# Altium project GF45RFSOI_Tapeout_DEC2020.PrjPcb
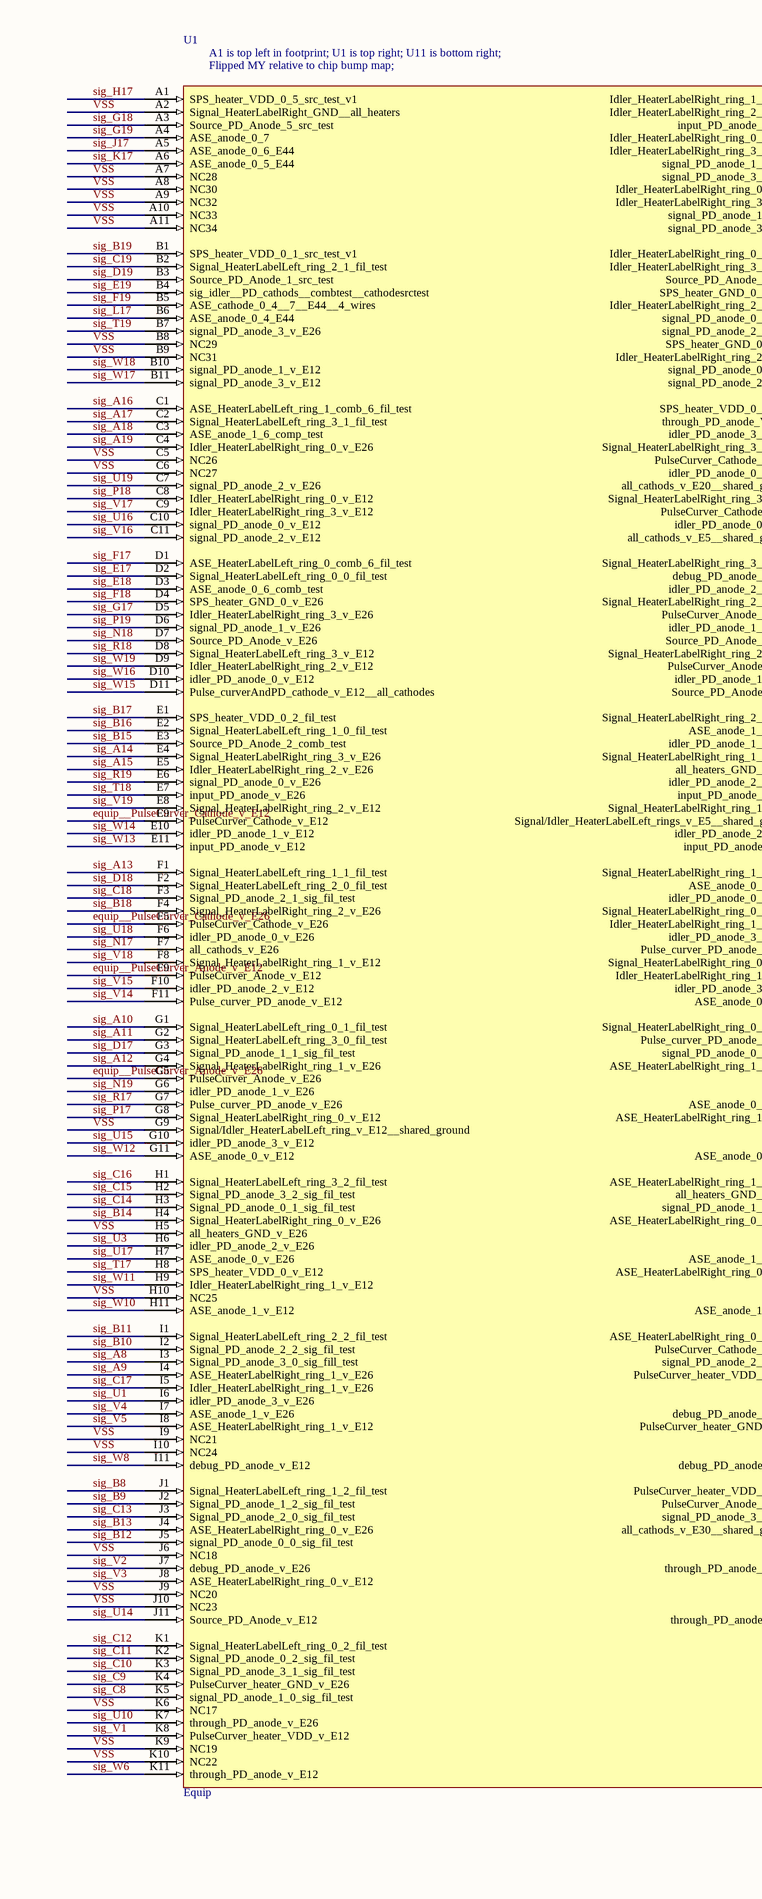
[diagram p0: Schematic.SchDoc, top left]
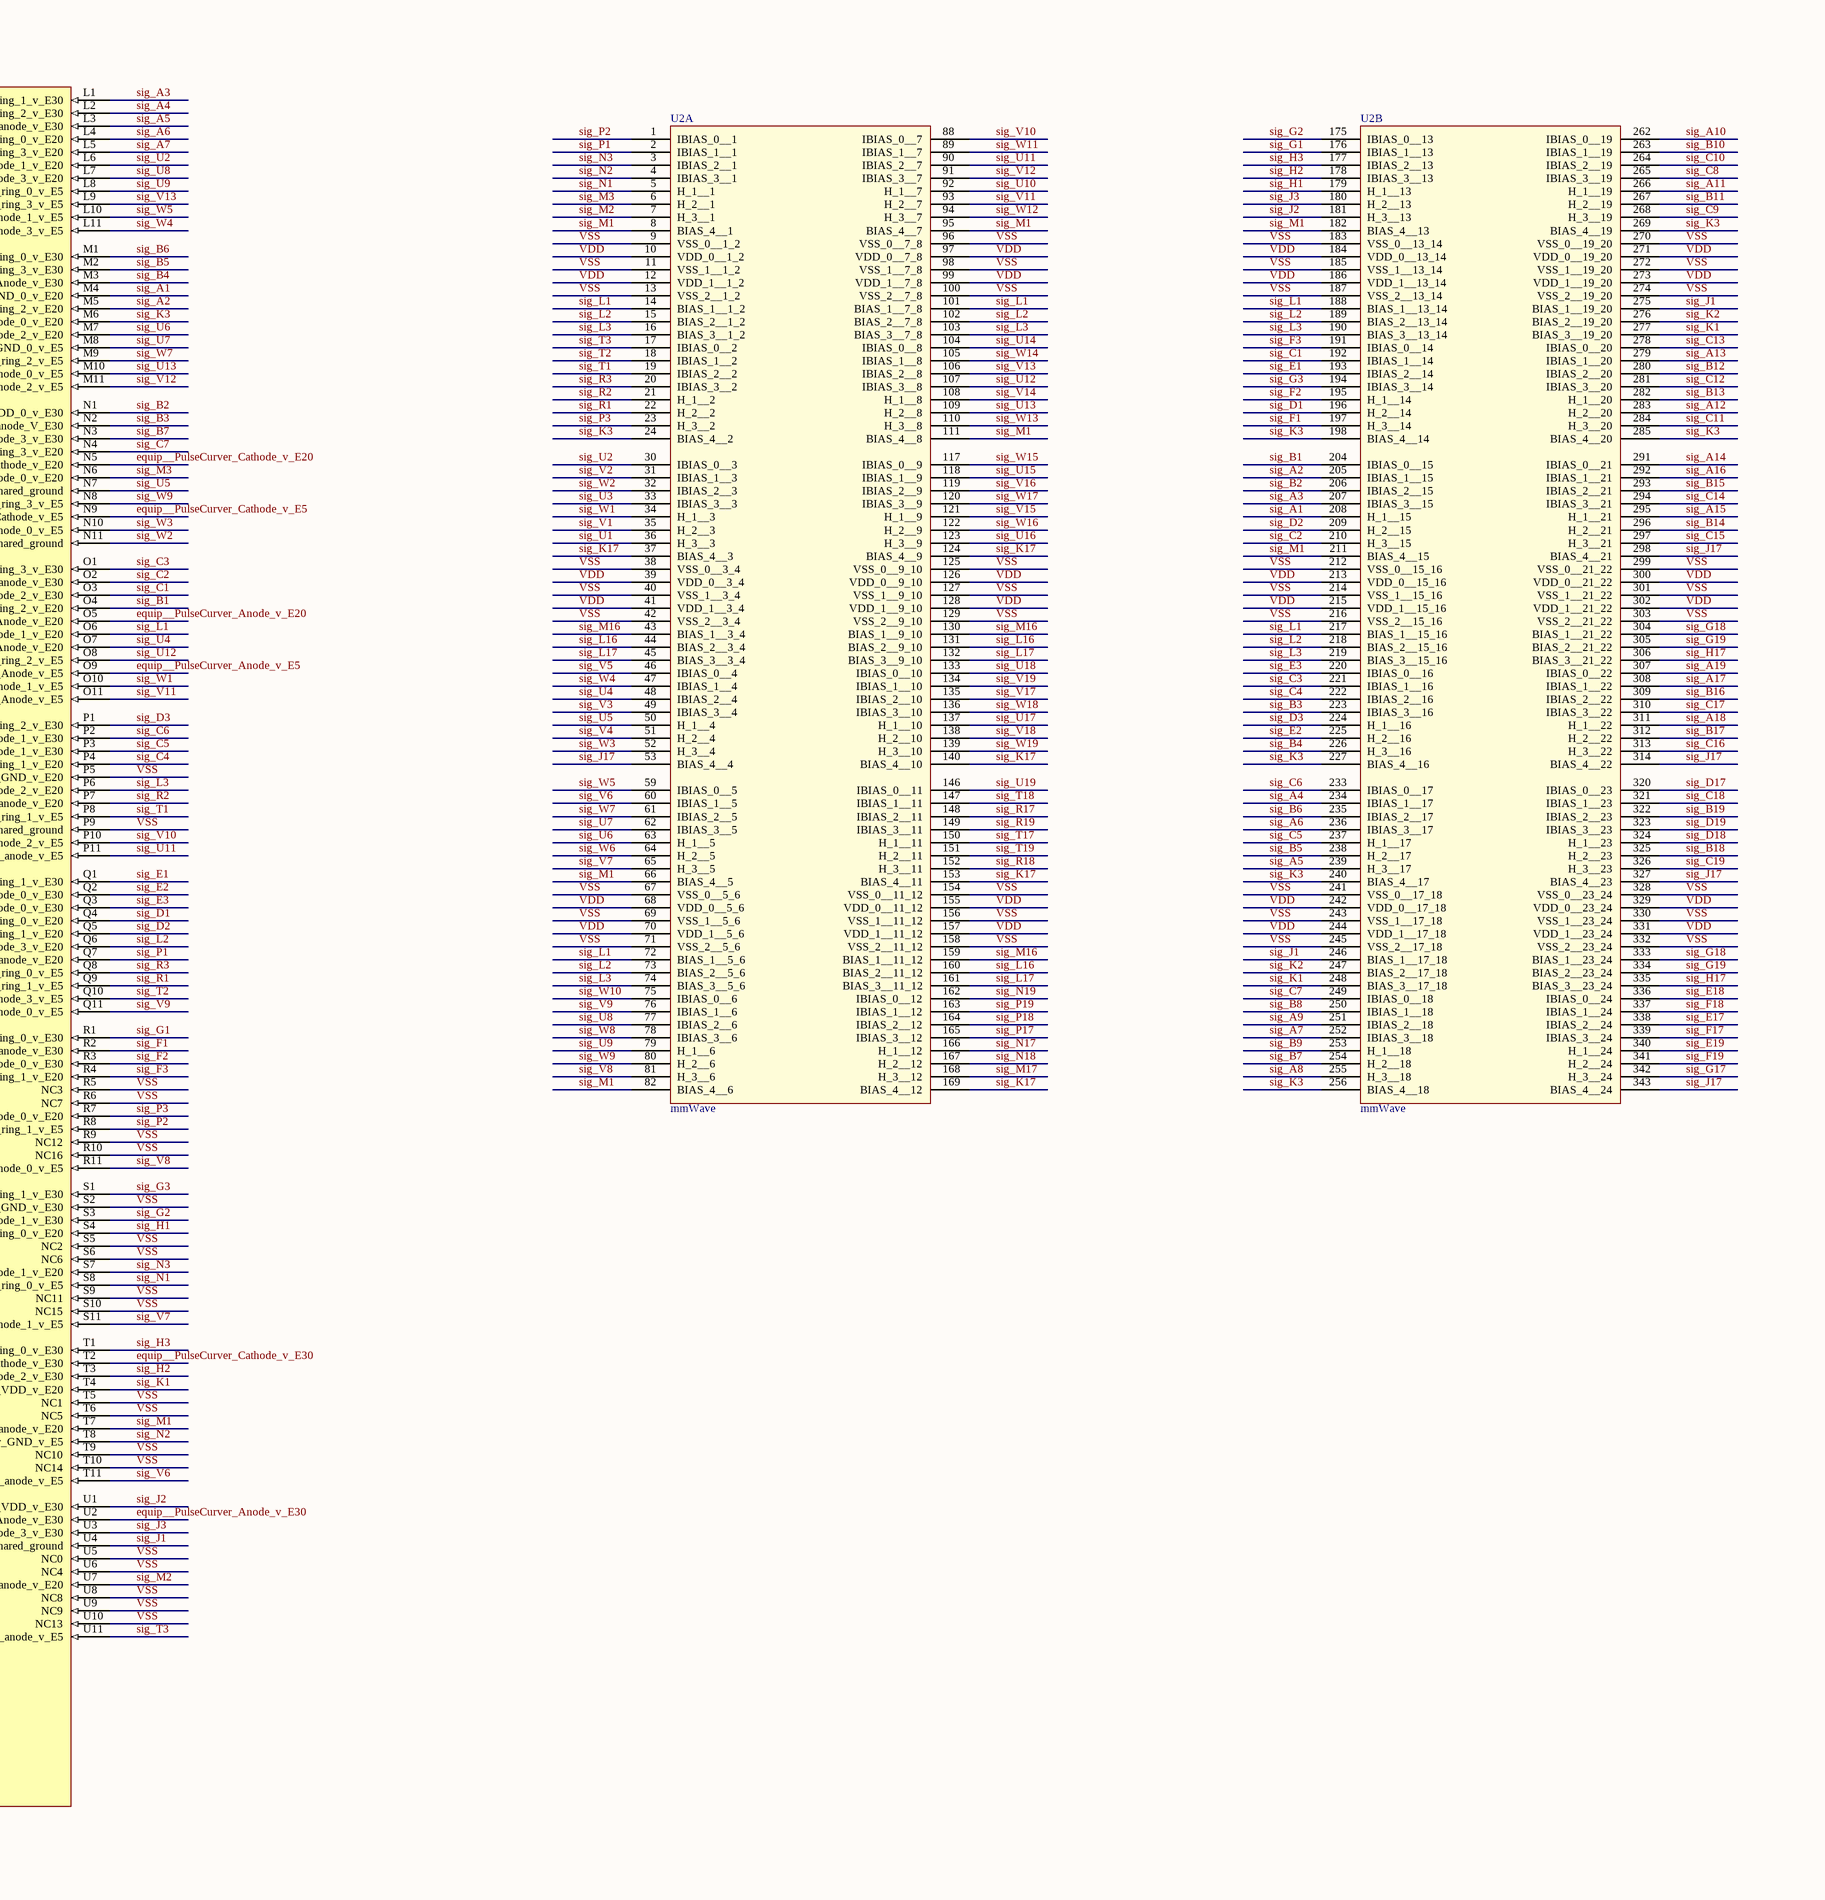
[diagram p1: Schematic.SchDoc, top middle]
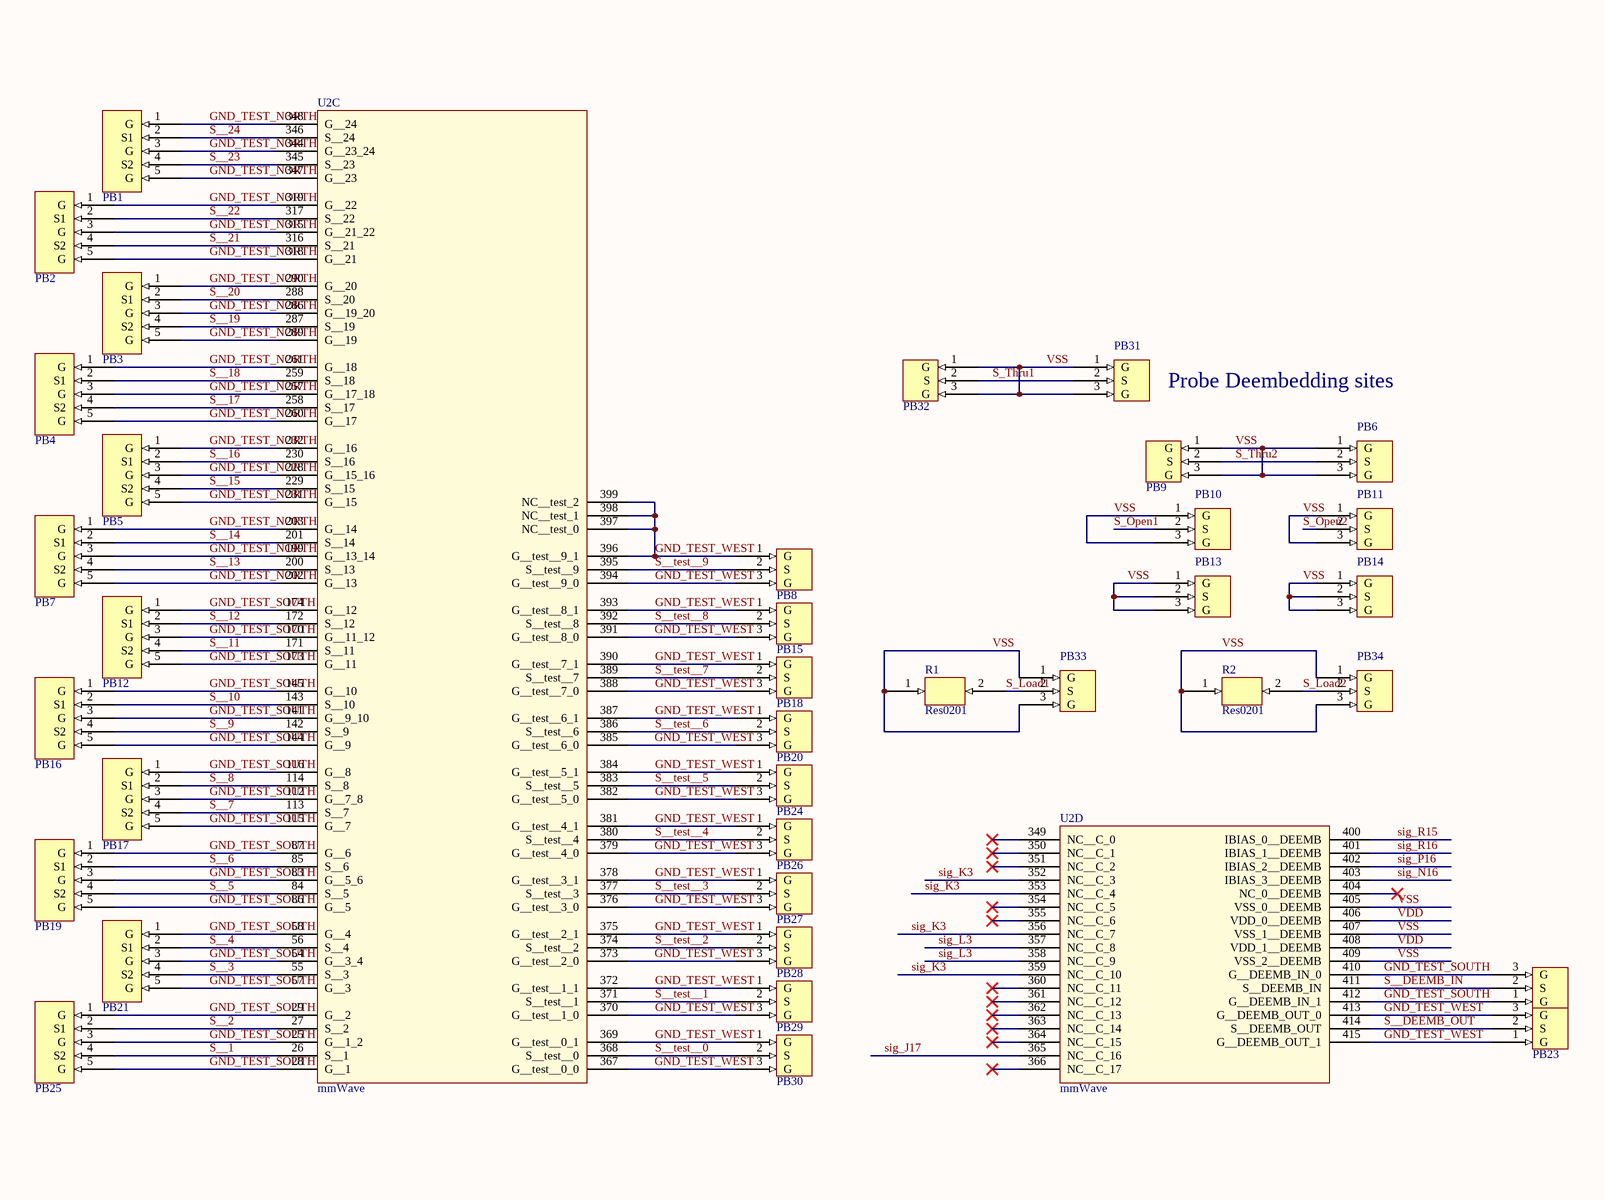
[diagram p2: Schematic.SchDoc, top right]
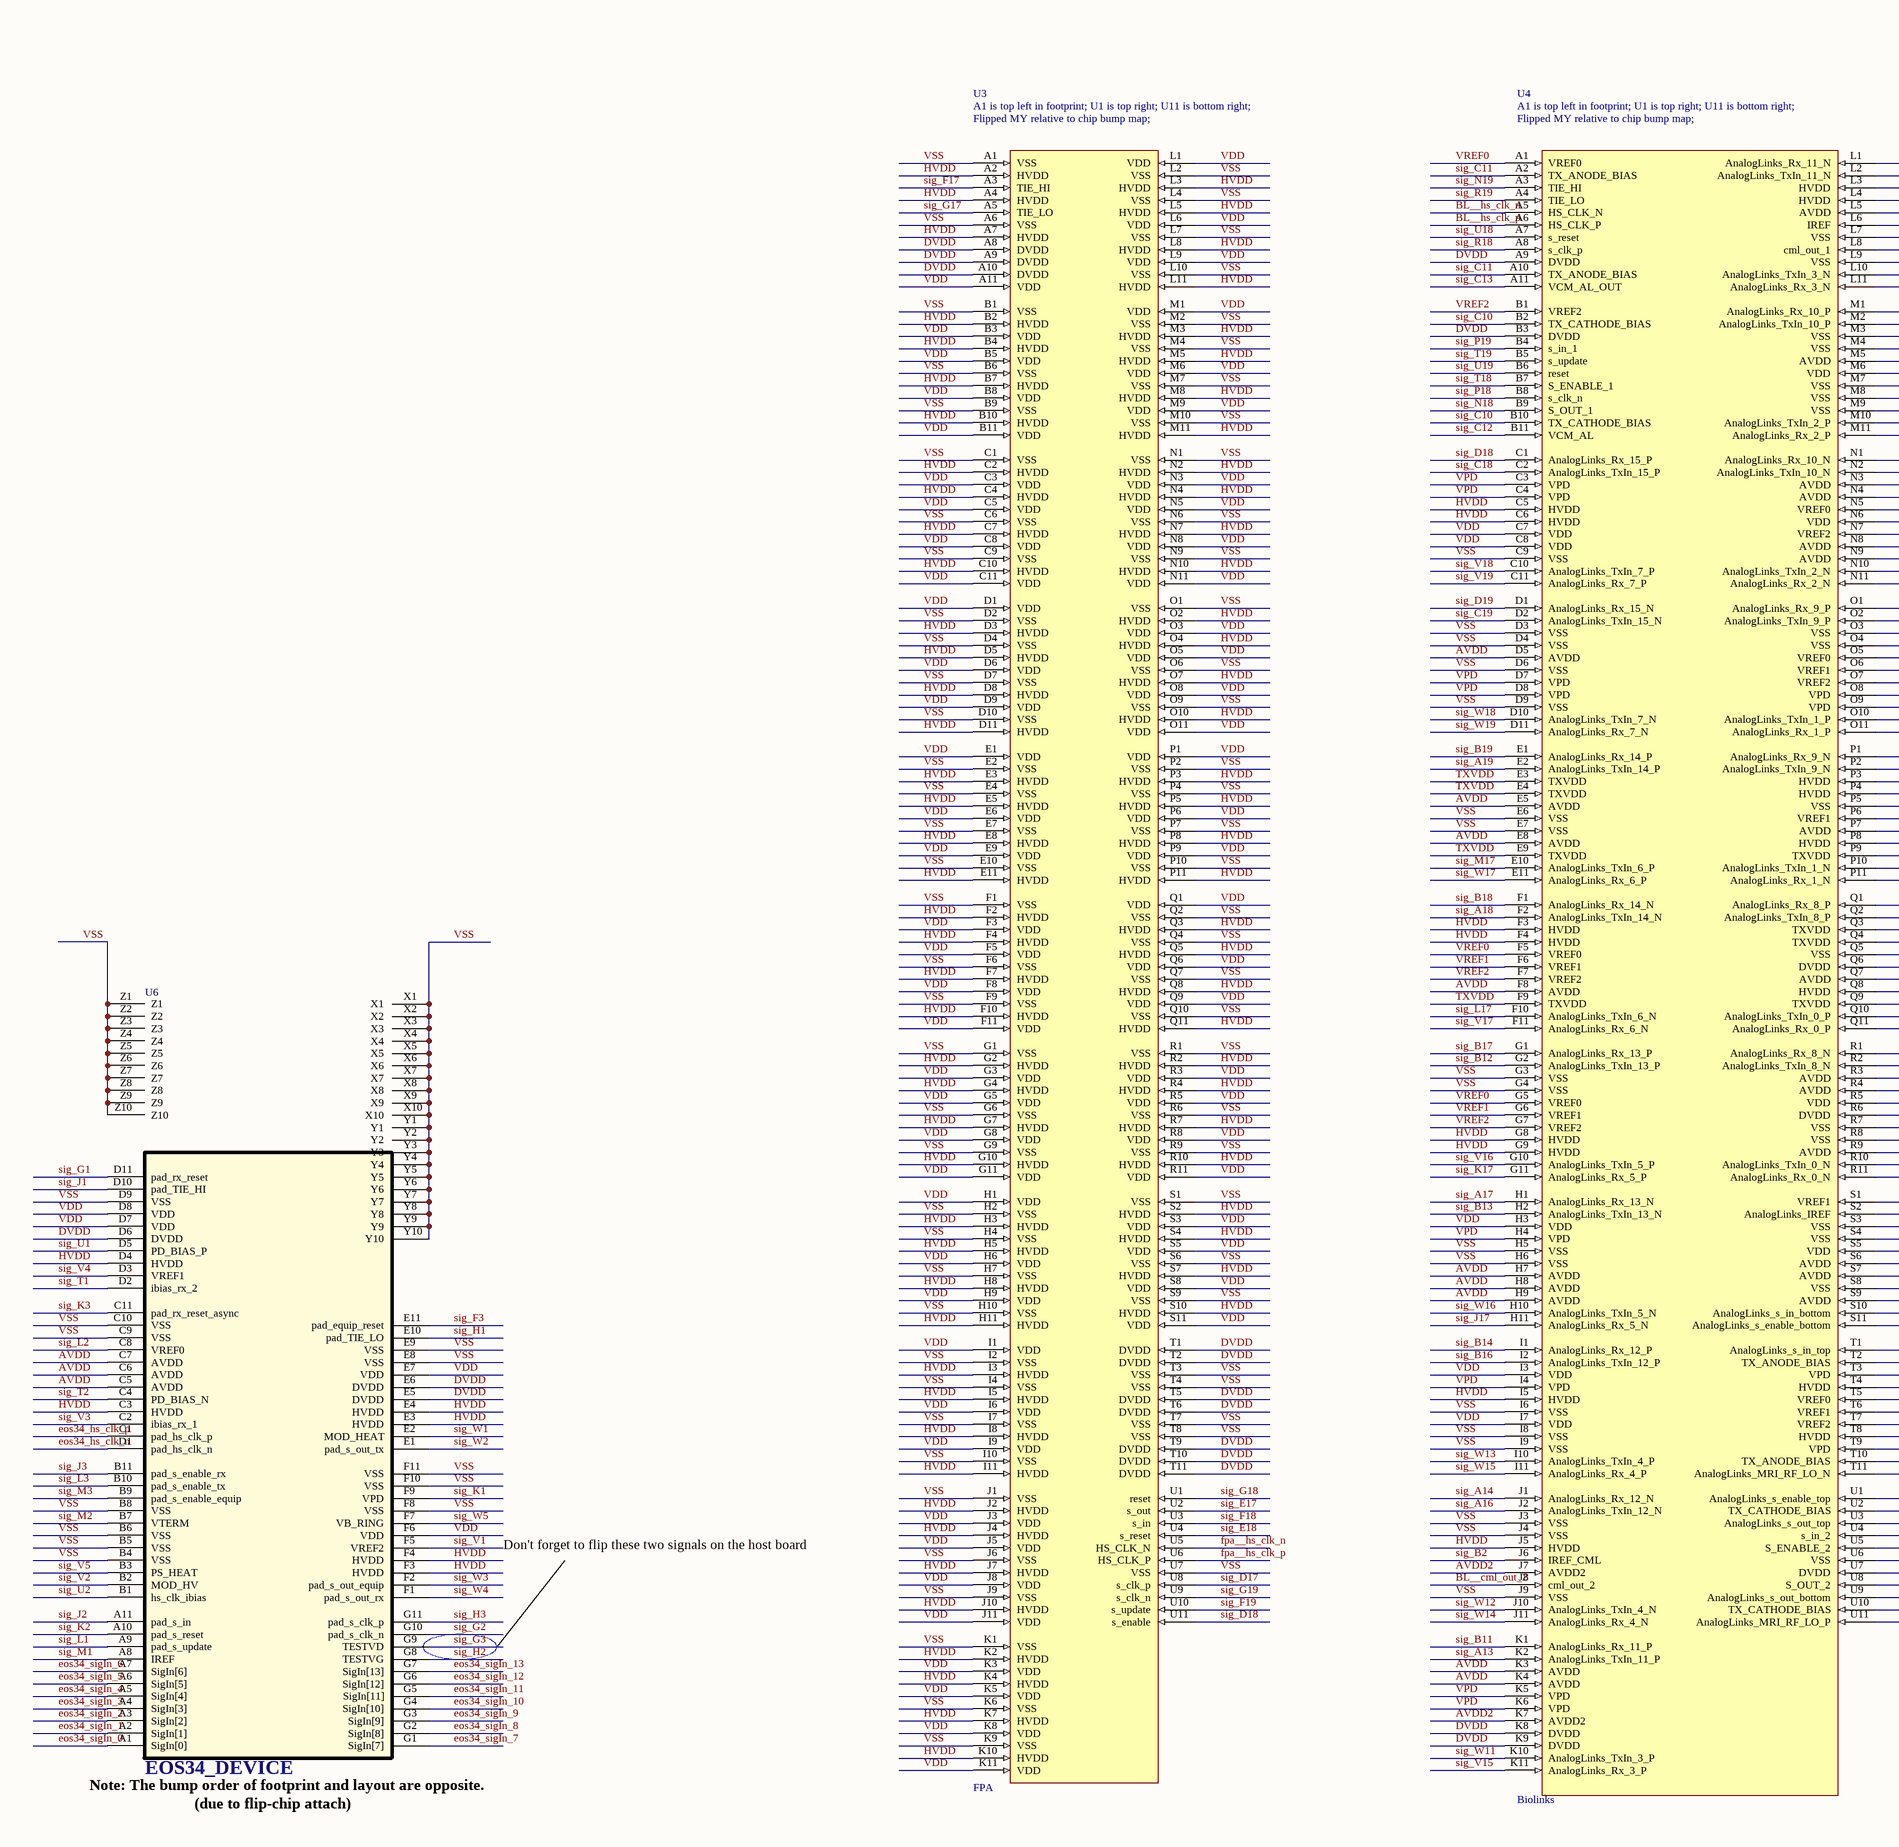
[diagram p3: Schematic.SchDoc, bottom left]
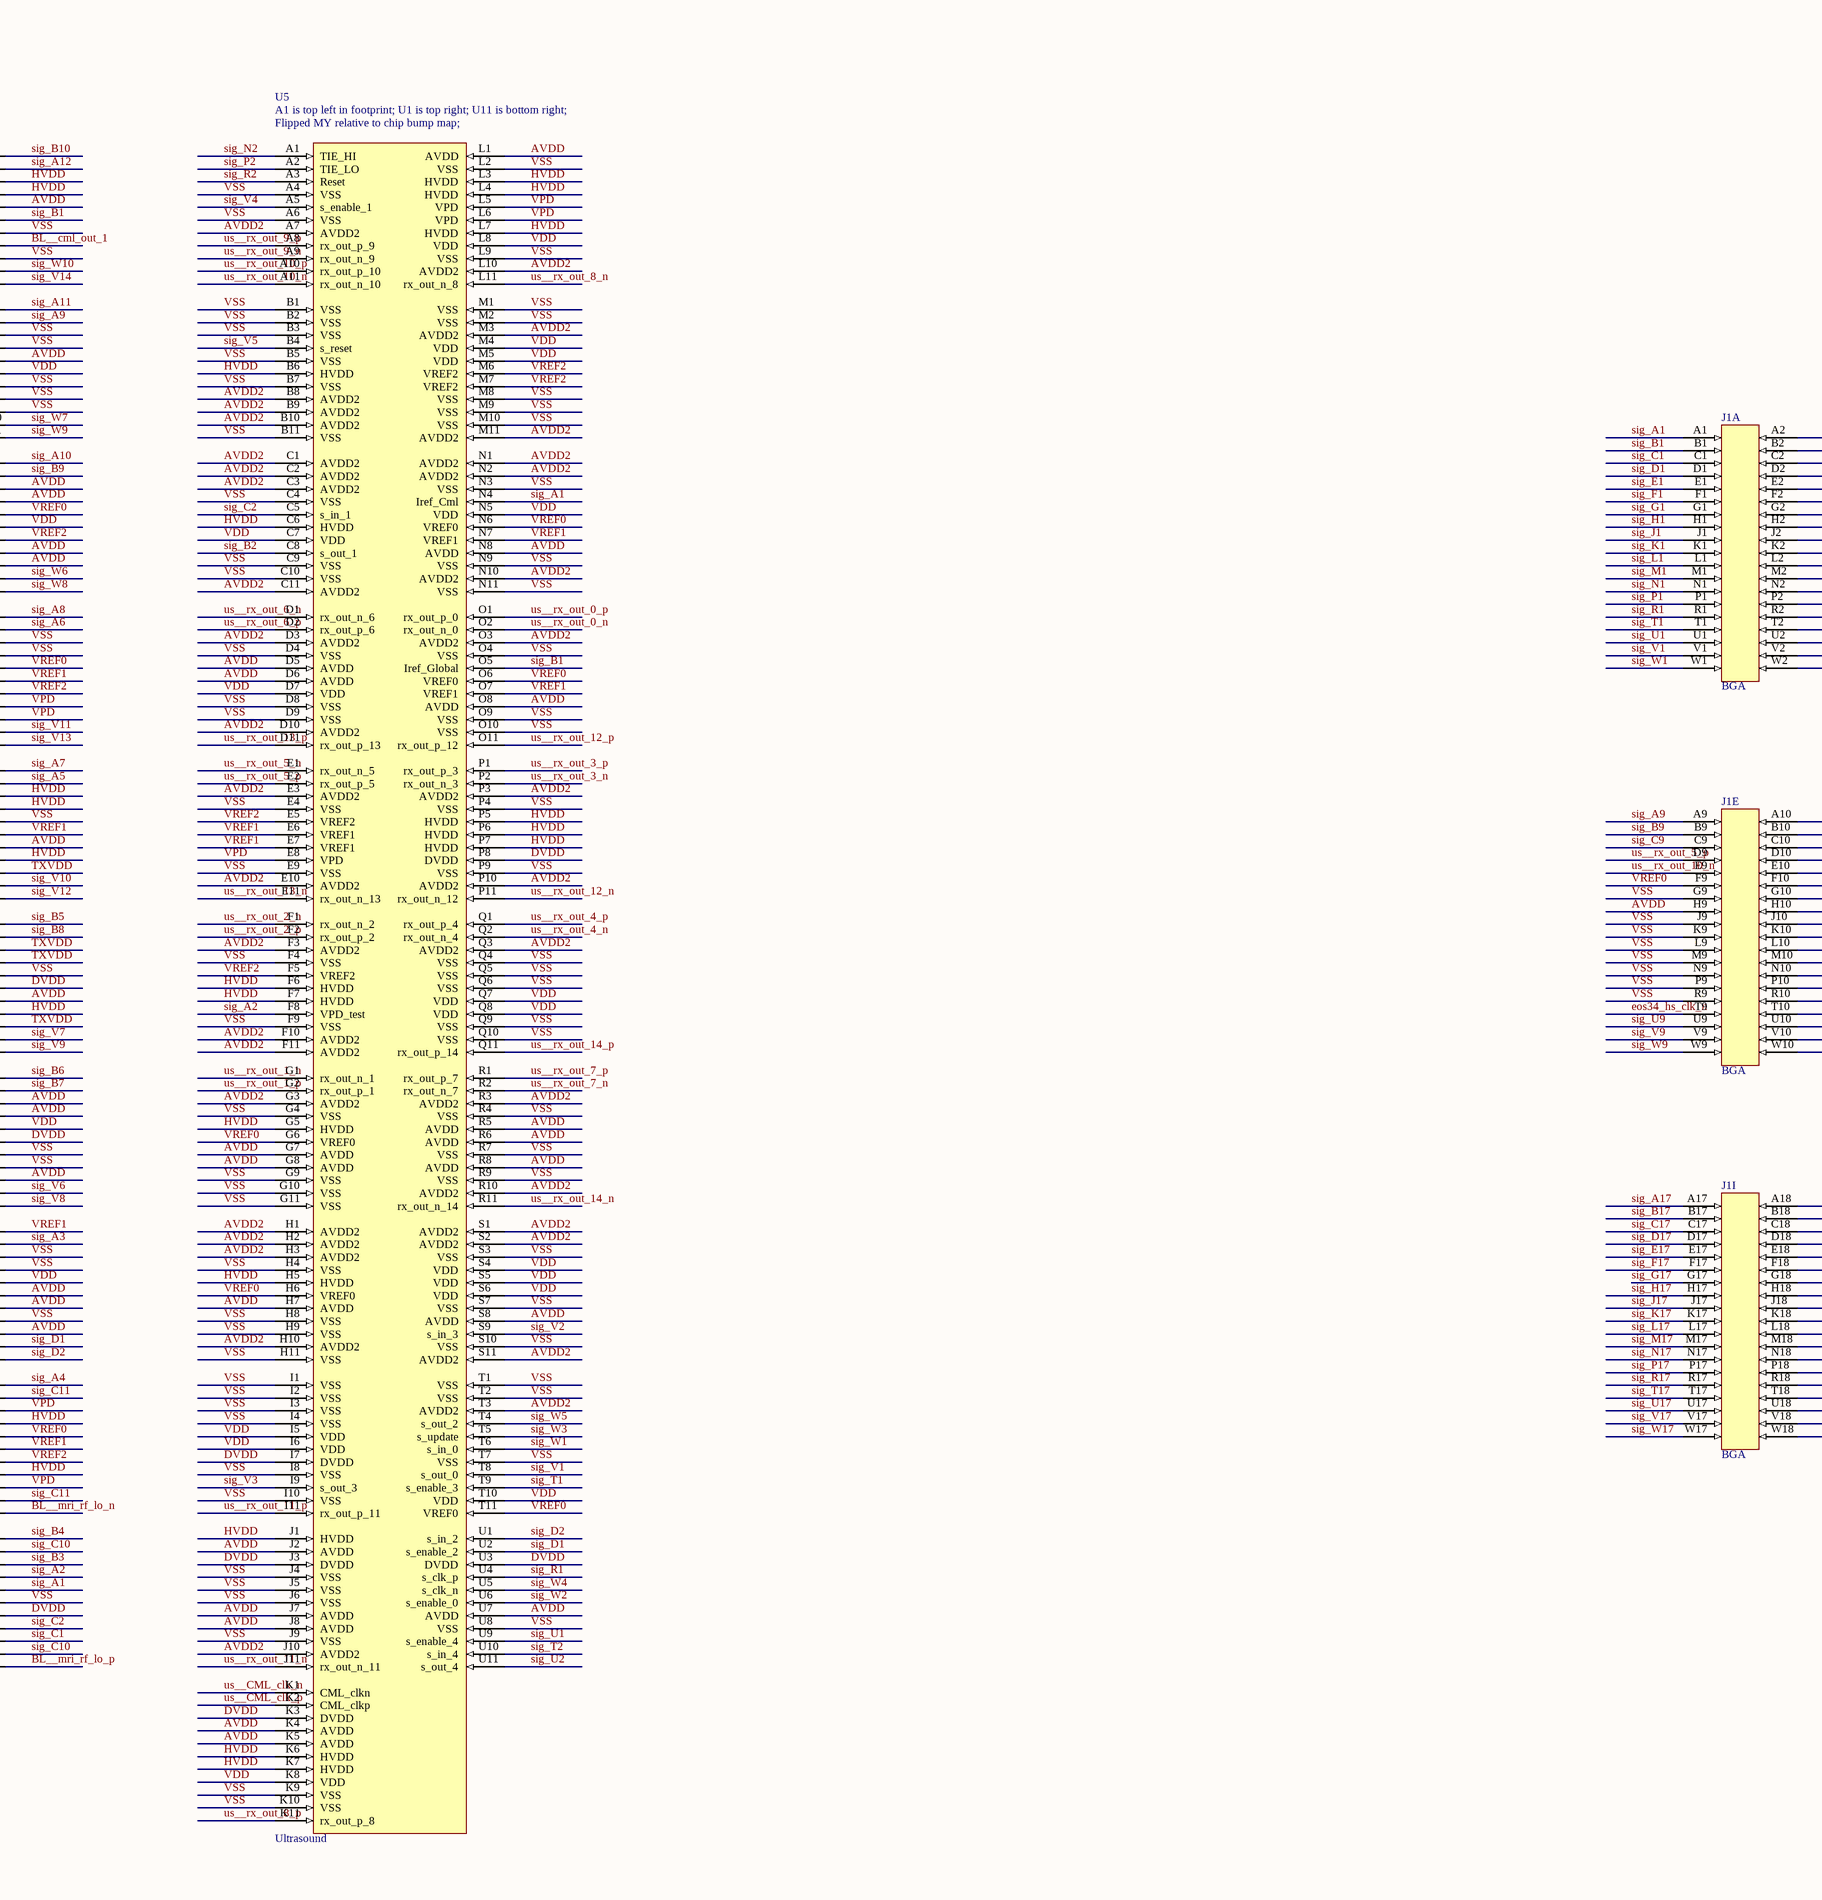
[diagram p4: Schematic.SchDoc, bottom middle]
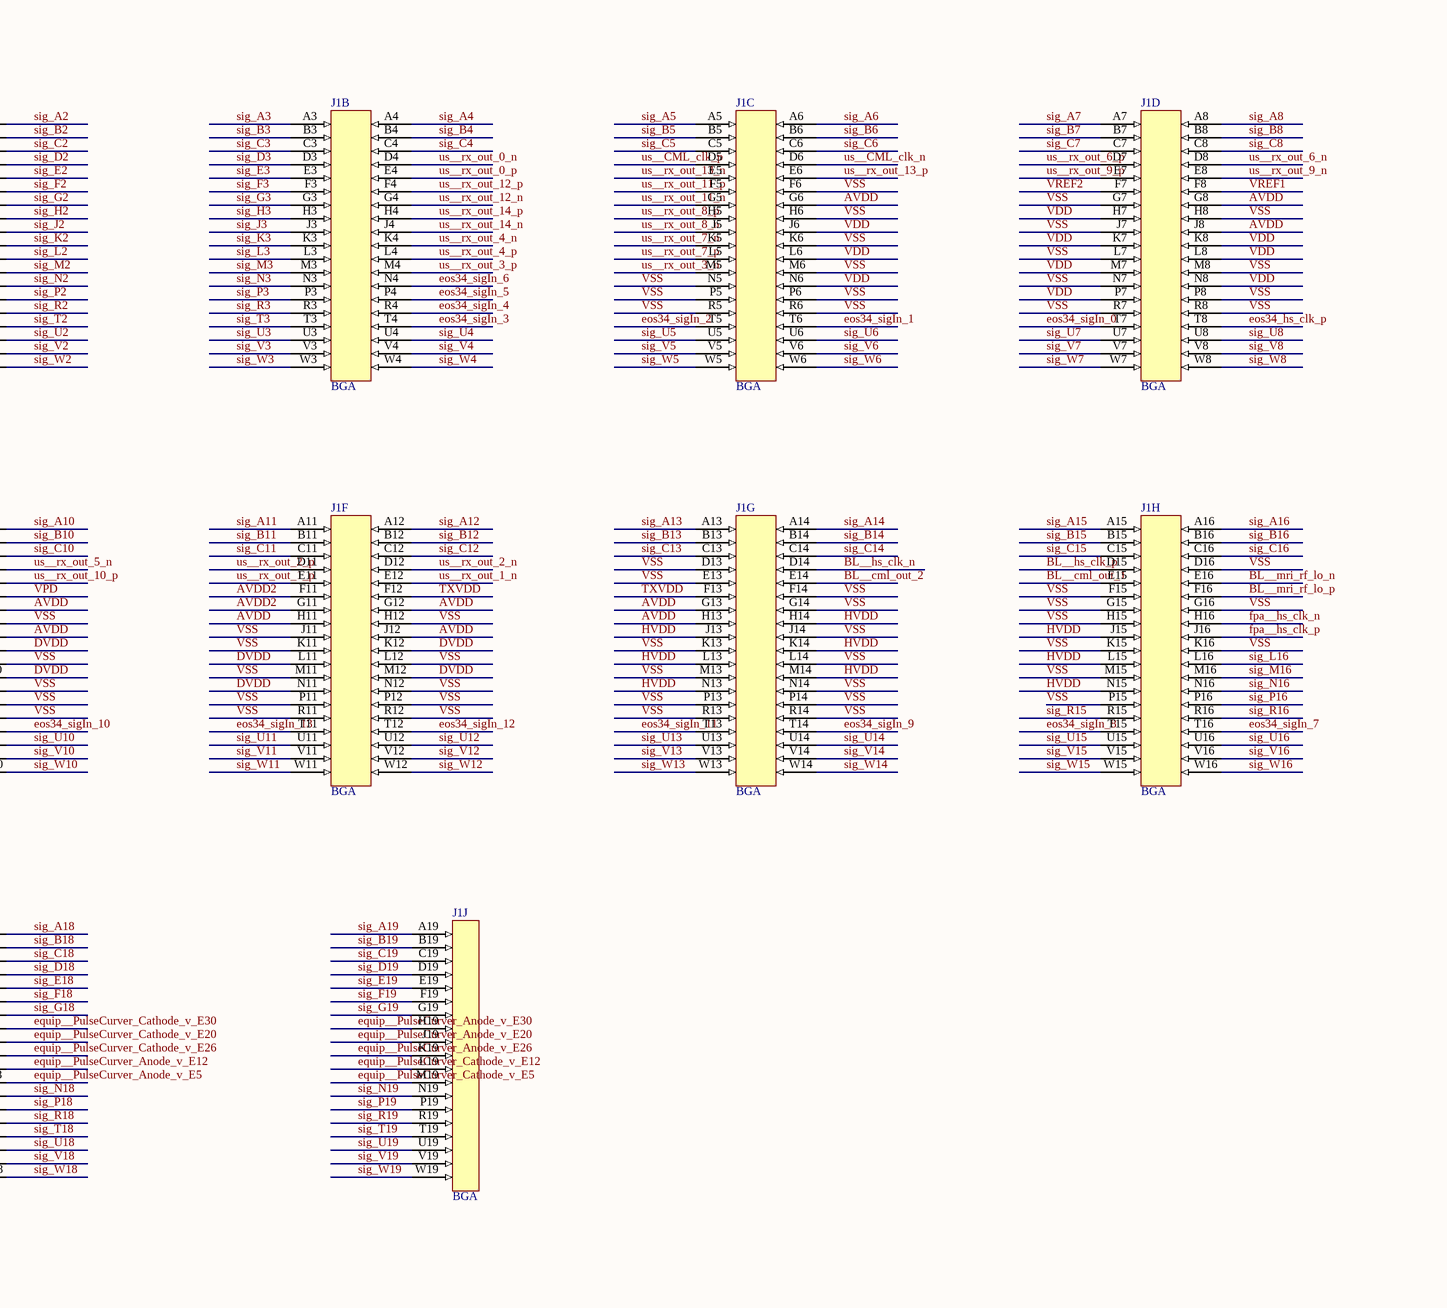
[diagram p5: Schematic.SchDoc, bottom right]
1 sheet, 43 parts. Net scope: global (net labels, ports and power ports of the same name join across sheets).
Board file: PCB.PcbDoc

## Sheet Schematic.SchDoc
size E; SheetNumber: 1; SheetTotal: 1

### Parts
J1  BGA  [BGA361x19]  (parts A,B,C,D,E,F,G,H,I,J of 10)
PB1  GSGSG  [GSGSG_Probe]  (value not drawn)
PB2  GSGSG  [GSGSG_Probe]  (value not drawn)
PB3  GSGSG  [GSGSG_Probe]  (value not drawn)
PB4  GSGSG  [GSGSG_Probe]  (value not drawn)
PB5  GSGSG  [GSGSG_Probe]  (value not drawn)
PB6  GSG_Probe_Pads  [GSG_Probe]  (value not drawn)
PB7  GSGSG  [GSGSG_Probe]  (value not drawn)
PB8  GSG_Probe_Pads  [GSG_Probe]  (value not drawn)
PB9  GSG_Probe_Pads  [GSG_Probe]  (value not drawn)
PB10  GSG_Probe_Pads  [GSG_Probe]  (value not drawn)
PB11  GSG_Probe_Pads  [GSG_Probe]  (value not drawn)
PB12  GSGSG  [GSGSG_Probe]  (value not drawn)
PB13  GSG_Probe_Pads  [GSG_Probe]  (value not drawn)
PB14  GSG_Probe_Pads  [GSG_Probe]  (value not drawn)
PB15  GSG_Probe_Pads  [GSG_Probe]  (value not drawn)
PB16  GSGSG  [GSGSG_Probe]  (value not drawn)
PB17  GSGSG  [GSGSG_Probe]  (value not drawn)
PB18  GSG_Probe_Pads  [GSG_Probe]  (value not drawn)
PB19  GSGSG  [GSGSG_Probe]  (value not drawn)
PB20  GSG_Probe_Pads  [GSG_Probe]  (value not drawn)
PB21  GSGSG  [GSGSG_Probe]  (value not drawn)
PB22  GSG_Probe_Pads  [GSG_Probe]  (value not drawn)
PB23  GSG_Probe_Pads  [GSG_Probe]  (value not drawn)
PB24  GSG_Probe_Pads  [GSG_Probe]  (value not drawn)
PB25  GSGSG  [GSGSG_Probe]  (value not drawn)
PB26  GSG_Probe_Pads  [GSG_Probe]  (value not drawn)
PB27  GSG_Probe_Pads  [GSG_Probe]  (value not drawn)
PB28  GSG_Probe_Pads  [GSG_Probe]  (value not drawn)
PB29  GSG_Probe_Pads  [GSG_Probe]  (value not drawn)
PB30  GSG_Probe_Pads  [GSG_Probe]  (value not drawn)
PB31  GSG_Probe_Pads  [GSG_Probe]  (value not drawn)
PB32  GSG_Probe_Pads  [GSG_Probe]  (value not drawn)
PB33  GSG_Probe_Pads  [GSG_Probe]  (value not drawn)
PB34  GSG_Probe_Pads  [GSG_Probe]  (value not drawn)
R1  Res0201  [Res0201_V2]
R2  Res0201  [Res0201_V2]
U1  Equip  [Bart_Bravo]
U2  mmWave  [mmWave]  (parts A,B,C,D of 4)
U3  FPA  [Bart_Bravo]
U4  Biolinks  [Bart_Bravo]
U5  Ultrasound  [Bart_Bravo]
U6  EOS34_DEVICE  [EOS34_device]

### Nets
AVDD: J1.G6 J1.G8 J1.G10 J1.G12 J1.G13 J1.H9 J1.H11 J1.H13 J1.J8 J1.J10 J1.J12 U4.D5(AVDD) U4.E5(AVDD) U4.E8(AVDD) U4.F8(AVDD) U4.H7(AVDD) U4.H8(AVDD) U4.H9(AVDD) U4.K3(AVDD) U4.K4(AVDD) U4.L5(AVDD) U4.M5(AVDD) U4.N3(AVDD) U4.N4(AVDD) U4.N8(AVDD) U4.N9(AVDD) U4.P7(AVDD) U4.Q7(AVDD) U4.R3(AVDD) U4.R4(AVDD) U4.R9(AVDD) U4.S6(AVDD) U4.S7(AVDD) U4.S9(AVDD) U5.D5(AVDD) U5.D6(AVDD) U5.G7(AVDD) U5.G8(AVDD) U5.H7(AVDD) U5.J2(AVDD) U5.J7(AVDD) U5.J8(AVDD) U5.K4(AVDD) U5.K5(AVDD) U5.L1(AVDD) U5.N8(AVDD) U5.O8(AVDD) U5.R5(AVDD) U5.R6(AVDD) U5.R8(AVDD) U5.S8(AVDD) U5.U7(AVDD) U6.C5(AVDD) U6.C6(AVDD) U6.C7(AVDD)
AVDD2: J1.F11 J1.G11 U4.J7(AVDD2) U4.K7(AVDD2) U5.A7(AVDD2) U5.B8(AVDD2) U5.B9(AVDD2) U5.B10(AVDD2) U5.C1(AVDD2) U5.C2(AVDD2) U5.C3(AVDD2) U5.C11(AVDD2) U5.D3(AVDD2) U5.D10(AVDD2) U5.E3(AVDD2) U5.E10(AVDD2) U5.F3(AVDD2) U5.F10(AVDD2) U5.F11(AVDD2) U5.G3(AVDD2) U5.H1(AVDD2) U5.H2(AVDD2) U5.H3(AVDD2) U5.H10(AVDD2) U5.J10(AVDD2) U5.L10(AVDD2) U5.M3(AVDD2) U5.M11(AVDD2) U5.N1(AVDD2) U5.N2(AVDD2) U5.N10(AVDD2) U5.O3(AVDD2) U5.P3(AVDD2) U5.P10(AVDD2) U5.Q3(AVDD2) U5.R3(AVDD2) U5.R10(AVDD2) U5.S1(AVDD2) U5.S2(AVDD2) U5.S11(AVDD2) U5.T3(AVDD2)
BL__cml_out_1: J1.E15 U4.L8(cml_out_1)
BL__cml_out_2: J1.E14 U4.J8(cml_out_2)
BL__hs_clk_n: J1.D14 U4.A5(HS_CLK_N)
BL__hs_clk_p: J1.D15 U4.A6(HS_CLK_P)
BL__mri_rf_lo_n: J1.E16 U4.T11(AnalogLinks_MRI_RF_LO_N)
BL__mri_rf_lo_p: J1.F16 U4.U11(AnalogLinks_MRI_RF_LO_P)
DVDD: J1.K10 J1.K12 J1.L11 J1.M10 J1.M12 J1.N11 U3.A8(DVDD) U3.A9(DVDD) U3.A10(DVDD) U3.T1(DVDD) U3.T2(DVDD) U3.T5(DVDD) U3.T6(DVDD) U3.T9(DVDD) U3.T10(DVDD) U3.T11(DVDD) U4.A9(DVDD) U4.B3(DVDD) U4.K8(DVDD) U4.K9(DVDD) U4.Q6(DVDD) U4.R6(DVDD) U4.U7(DVDD) U5.I7(DVDD) U5.J3(DVDD) U5.K3(DVDD) U5.P8(DVDD) U5.U3(DVDD) U6.D6(DVDD) U6.E5(DVDD) U6.E6(DVDD)
eos34_hs_clk_n: J1.T9 U6.D1(pad_hs_clk_n)
eos34_hs_clk_p: J1.T8 U6.C1(pad_hs_clk_p)
eos34_sigIn_0: J1.T7 U6.A1(SigIn[0])
eos34_sigIn_1: J1.T6 U6.A2(SigIn[1])
eos34_sigIn_2: J1.T5 U6.A3(SigIn[2])
eos34_sigIn_3: J1.T4 U6.A4(SigIn[3])
eos34_sigIn_4: J1.R4 U6.A5(SigIn[4])
eos34_sigIn_5: J1.P4 U6.A6(SigIn[5])
eos34_sigIn_6: J1.N4 U6.A7(SigIn[6])
eos34_sigIn_7: J1.T16 U6.G1(SigIn[7])
eos34_sigIn_8: J1.T15 U6.G2(SigIn[8])
eos34_sigIn_9: J1.T14 U6.G3(SigIn[9])
eos34_sigIn_10: J1.T10 U6.G4(SigIn[10])
eos34_sigIn_11: J1.T13 U6.G5(SigIn[11])
eos34_sigIn_12: J1.T12 U6.G6(SigIn[12])
eos34_sigIn_13: J1.T11 U6.G7(SigIn[13])
equip__PulseCurver_Anode_v_E5: J1.M18 U1.O9(PulseCurver_Anode_v_E5)
equip__PulseCurver_Anode_v_E12: J1.L18 U1.F9(PulseCurver_Anode_v_E12)
equip__PulseCurver_Anode_v_E20: J1.J19 U1.O5(PulseCurver_Anode_v_E20)
equip__PulseCurver_Anode_v_E26: J1.K19 U1.G5(PulseCurver_Anode_v_E26)
equip__PulseCurver_Anode_v_E30: J1.H19 U1.U2(PulseCurver_Anode_v_E30)
equip__PulseCurver_Cathode_v_E5: J1.M19 U1.N9(PulseCurver_Cathode_v_E5)
equip__PulseCurver_Cathode_v_E12: J1.L19 U1.E9(PulseCurver_Cathode_v_E12)
equip__PulseCurver_Cathode_v_E20: J1.J18 U1.N5(PulseCurver_Cathode_v_E20)
equip__PulseCurver_Cathode_v_E26: J1.K18 U1.F5(PulseCurver_Cathode_v_E26)
equip__PulseCurver_Cathode_v_E30: J1.H18 U1.T2(PulseCurver_Cathode_v_E30)
fpa__hs_clk_n: J1.H16 U3.U5(HS_CLK_N)
fpa__hs_clk_p: J1.J16 U3.U6(HS_CLK_P)
GND_TEST_NORTH: PB1.1(G) PB1.3(G) PB1.5(G) PB2.1(G) PB2.3(G) PB2.5(G) PB3.1(G) PB3.3(G) PB3.5(G) PB4.1(G) PB4.3(G) PB4.5(G) PB5.1(G) PB5.3(G) PB5.5(G) PB7.1(G) PB7.3(G) PB7.5(G) U2.199(G__13_14) U2.202(G__13) U2.203(G__14) U2.228(G__15_16) U2.231(G__15) U2.232(G__16) U2.257(G__17_18) U2.260(G__17) U2.261(G__18) U2.286(G__19_20) U2.289(G__19) U2.290(G__20) U2.315(G__21_22) U2.318(G__21) U2.319(G__22) U2.344(G__23_24) U2.347(G__23) U2.348(G__24)
GND_TEST_SOUTH: PB12.1(G) PB12.3(G) PB12.5(G) PB16.1(G) PB16.3(G) PB16.5(G) PB17.1(G) PB17.3(G) PB17.5(G) PB19.1(G) PB19.3(G) PB19.5(G) PB21.1(G) PB21.3(G) PB21.5(G) PB22.1(G) PB22.3(G) PB25.1(G) PB25.3(G) PB25.5(G) U2.25(G__1_2) U2.28(G__1) U2.29(G__2) U2.54(G__3_4) U2.57(G__3) U2.58(G__4) U2.83(G__5_6) U2.86(G__5) U2.87(G__6) U2.112(G__7_8) U2.115(G__7) U2.116(G__8) U2.141(G__9_10) U2.144(G__9) U2.145(G__10) U2.170(G__11_12) U2.173(G__11) U2.174(G__12) U2.410(G__DEEMB_IN_0) U2.412(G__DEEMB_IN_1)
GND_TEST_WEST: PB8.1(G) PB8.3(G) PB15.1(G) PB15.3(G) PB18.1(G) PB18.3(G) PB20.1(G) PB20.3(G) PB23.1(G) PB23.3(G) PB24.1(G) PB24.3(G) PB26.1(G) PB26.3(G) PB27.1(G) PB27.3(G) PB28.1(G) PB28.3(G) PB29.1(G) PB29.3(G) PB30.1(G) PB30.3(G) U2.367(G__test__0_0) U2.369(G__test__0_1) U2.370(G__test__1_0) U2.372(G__test__1_1) U2.373(G__test__2_0) U2.375(G__test__2_1) U2.376(G__test__3_0) U2.378(G__test__3_1) U2.379(G__test__4_0) U2.381(G__test__4_1) U2.382(G__test__5_0) U2.384(G__test__5_1) U2.385(G__test__6_0) U2.387(G__test__6_1) U2.388(G__test__7_0) U2.390(G__test__7_1) U2.391(G__test__8_0) U2.393(G__test__8_1) U2.394(G__test__9_0) U2.396(G__test__9_1) U2.397(NC__test_0) U2.398(NC__test_1) U2.399(NC__test_2) U2.413(G__DEEMB_OUT_0) U2.415(G__DEEMB_OUT_1)
HVDD: J1.H14 J1.J13 J1.J15 J1.K14 J1.L13 J1.L15 J1.M14 J1.N13 J1.N15 U3.A2(HVDD) U3.A4(HVDD) U3.A7(HVDD) U3.B2(HVDD) U3.B4(HVDD) U3.B7(HVDD) U3.B10(HVDD) U3.C2(HVDD) U3.C4(HVDD) U3.C7(HVDD) U3.C10(HVDD) U3.D3(HVDD) U3.D5(HVDD) U3.D8(HVDD) U3.D11(HVDD) U3.E3(HVDD) U3.E5(HVDD) U3.E8(HVDD) U3.E11(HVDD) U3.F2(HVDD) U3.F4(HVDD) U3.F7(HVDD) U3.F10(HVDD) U3.G2(HVDD) U3.G4(HVDD) U3.G7(HVDD) U3.G10(HVDD) U3.H3(HVDD) U3.H5(HVDD) U3.H8(HVDD) U3.H11(HVDD) U3.I3(HVDD) U3.I5(HVDD) U3.I8(HVDD) U3.I11(HVDD) U3.J2(HVDD) U3.J4(HVDD) U3.J7(HVDD) U3.J10(HVDD) U3.K2(HVDD) U3.K4(HVDD) U3.K7(HVDD) U3.K10(HVDD) U3.L3(HVDD) U3.L5(HVDD) U3.L8(HVDD) U3.L11(HVDD) U3.M3(HVDD) U3.M5(HVDD) U3.M8(HVDD) U3.M11(HVDD) U3.N2(HVDD) U3.N4(HVDD) U3.N7(HVDD) U3.N10(HVDD) U3.O2(HVDD) U3.O4(HVDD) U3.O7(HVDD) U3.O10(HVDD) U3.P3(HVDD) U3.P5(HVDD) U3.P8(HVDD) U3.P11(HVDD) U3.Q3(HVDD) U3.Q5(HVDD) U3.Q8(HVDD) U3.Q11(HVDD) U3.R2(HVDD) U3.R4(HVDD) U3.R7(HVDD) U3.R10(HVDD) U3.S2(HVDD) U3.S4(HVDD) U3.S7(HVDD) U3.S10(HVDD) U4.C5(HVDD) U4.C6(HVDD) U4.F3(HVDD) U4.F4(HVDD) U4.G8(HVDD) U4.G9(HVDD) U4.I5(HVDD) U4.J5(HVDD) U4.L3(HVDD) U4.L4(HVDD) U4.P3(HVDD) U4.P4(HVDD) U4.P8(HVDD) U4.Q8(HVDD) U4.T4(HVDD) U4.T8(HVDD) U5.B6(HVDD) U5.C6(HVDD) U5.F6(HVDD) U5.F7(HVDD) U5.G5(HVDD) U5.H5(HVDD) U5.J1(HVDD) U5.K6(HVDD) U5.K7(HVDD) U5.L3(HVDD) U5.L4(HVDD) U5.L7(HVDD) U5.P5(HVDD) U5.P6(HVDD) U5.P7(HVDD) U6.C3(HVDD) U6.D4(HVDD) U6.E3(HVDD) U6.E4(HVDD) U6.F3(HVDD) U6.F4(HVDD)
S__1: PB25.4(S2) U2.26(S__1)
S__2: PB25.2(S1) U2.27(S__2)
S__3: PB21.4(S2) U2.55(S__3)
S__4: PB21.2(S1) U2.56(S__4)
S__5: PB19.4(S2) U2.84(S__5)
S__6: PB19.2(S1) U2.85(S__6)
S__7: PB17.4(S2) U2.113(S__7)
S__8: PB17.2(S1) U2.114(S__8)
S__9: PB16.4(S2) U2.142(S__9)
S__10: PB16.2(S1) U2.143(S__10)
S__11: PB12.4(S2) U2.171(S__11)
S__12: PB12.2(S1) U2.172(S__12)
S__13: PB7.4(S2) U2.200(S__13)
S__14: PB7.2(S1) U2.201(S__14)
S__15: PB5.4(S2) U2.229(S__15)
S__16: PB5.2(S1) U2.230(S__16)
S__17: PB4.4(S2) U2.258(S__17)
S__18: PB4.2(S1) U2.259(S__18)
S__19: PB3.4(S2) U2.287(S__19)
S__20: PB3.2(S1) U2.288(S__20)
S__21: PB2.4(S2) U2.316(S__21)
S__22: PB2.2(S1) U2.317(S__22)
S__23: PB1.4(S2) U2.345(S__23)
S__24: PB1.2(S1) U2.346(S__24)
S__DEEMB_IN: PB22.2(S) U2.411(S__DEEMB_IN)
S__DEEMB_OUT: PB23.2(S) U2.414(S__DEEMB_OUT)
S__test__0: PB30.2(S) U2.368(S__test__0)
S__test__1: PB29.2(S) U2.371(S__test__1)
S__test__2: PB28.2(S) U2.374(S__test__2)
S__test__3: PB27.2(S) U2.377(S__test__3)
S__test__4: PB26.2(S) U2.380(S__test__4)
S__test__5: PB24.2(S) U2.383(S__test__5)
S__test__6: PB20.2(S) U2.386(S__test__6)
S__test__7: PB18.2(S) U2.389(S__test__7)
S__test__8: PB15.2(S) U2.392(S__test__8)
S__test__9: PB8.2(S) U2.395(S__test__9)
S_Load1: PB33.2(S) R1.2
S_Load2: PB34.2(S) R2.2
S_Open1: PB10.2(S)
S_Open2: PB11.2(S)
S_Thru1: PB31.2(S) PB32.2(S)
S_Thru2: PB6.2(S) PB9.2(S)
sig_A1: J1.A1 U1.M4(SPS_heater_GND_0_v_E20) U2.208(H_1__15) U4.U5(S_ENABLE_2) U5.N4(Iref_Cml)
sig_A2: J1.A2 U1.M5(Idler_HeaterLabelRight_ring_2_v_E20) U2.205(IBIAS_1__15) U4.U4(s_in_2) U5.F8(VPD_test)
sig_A3: J1.A3 U1.L1(Idler_HeaterLabelRight_ring_1_v_E30) U2.207(IBIAS_3__15) U4.S2(AnalogLinks_IREF)
sig_A4: J1.A4 U1.L2(Idler_HeaterLabelRight_ring_2_v_E30) U2.234(IBIAS_1__17) U4.T1(AnalogLinks_s_in_top)
sig_A5: J1.A5 U1.L3(input_PD_anode_v_E30) U2.239(H_3__17) U4.P2(AnalogLinks_TxIn_9_N)
sig_A6: J1.A6 U1.L4(Idler_HeaterLabelRight_ring_0_v_E20) U2.236(IBIAS_3__17) U4.O2(AnalogLinks_TxIn_9_P)
sig_A7: J1.A7 U1.L5(Idler_HeaterLabelRight_ring_3_v_E20) U2.252(IBIAS_3__18) U4.P1(AnalogLinks_Rx_9_N)
sig_A8: J1.A8 U1.I3(Signal_PD_anode_3_0_sig_fill_test) U2.255(H_3__18) U4.O1(AnalogLinks_Rx_9_P)
sig_A9: J1.A9 U1.I4(ASE_HeaterLabelRight_ring_1_v_E26) U2.251(IBIAS_2__18) U4.M2(AnalogLinks_TxIn_10_P)
sig_A10: J1.A10 U1.G1(Signal_HeaterLabelLeft_ring_0_1_fil_test) U2.262(IBIAS_0__19) U4.N1(AnalogLinks_Rx_10_N)
sig_A11: J1.A11 U1.G2(Signal_HeaterLabelLeft_ring_3_0_fil_test) U2.266(H_1__19) U4.M1(AnalogLinks_Rx_10_P)
sig_A12: J1.A12 U1.G4(Signal_HeaterLabelRight_ring_1_v_E26) U2.283(H_2__20) U4.L2(AnalogLinks_TxIn_11_N)
sig_A13: J1.A13 U1.F1(Signal_HeaterLabelLeft_ring_1_1_fil_test) U2.279(IBIAS_1__20) U4.K2(AnalogLinks_TxIn_11_P)
sig_A14: J1.A14 U1.E4(Signal_HeaterLabelRight_ring_3_v_E26) U2.291(IBIAS_0__21) U4.J1(AnalogLinks_Rx_12_N)
sig_A15: J1.A15 U1.E5(Idler_HeaterLabelRight_ring_2_v_E26) U2.295(H_1__21)
sig_A16: J1.A16 U1.C1(ASE_HeaterLabelLeft_ring_1_comb_6_fil_test) U2.292(IBIAS_1__21) U4.J2(AnalogLinks_TxIn_12_N)
sig_A17: J1.A17 U1.C2(Signal_HeaterLabelLeft_ring_3_1_fil_test) U2.308(IBIAS_1__22) U4.H1(AnalogLinks_Rx_13_N)
sig_A18: J1.A18 U1.C3(ASE_anode_1_6_comp_test) U2.311(H_1__22) U4.F2(AnalogLinks_TxIn_14_N)
sig_A19: J1.A19 U1.C4(Idler_HeaterLabelRight_ring_0_v_E26) U2.307(IBIAS_0__22) U4.E2(AnalogLinks_TxIn_14_P)
sig_B1: J1.B1 U1.O4(Signal_HeaterLabelRight_ring_2_v_E20) U2.204(IBIAS_0__15) U4.L6(IREF) U5.O5(Iref_Global)
sig_B2: J1.B2 U1.N1(SPS_heater_VDD_0_v_E30) U2.206(IBIAS_2__15) U4.J6(IREF_CML) U5.C8(s_out_1)
sig_B3: J1.B3 U1.N2(through_PD_anode_V_E30) U2.223(IBIAS_3__16) U4.U3(AnalogLinks_s_out_top)
sig_B4: J1.B4 U1.M3(Source_PD_Anode_v_E30) U2.226(H_3__16) U4.U1(AnalogLinks_s_enable_top)
sig_B5: J1.B5 U1.M2(Idler_HeaterLabelRight_ring_3_v_E30) U2.238(H_2__17) U4.Q1(AnalogLinks_Rx_8_P)
sig_B6: J1.B6 U1.M1(Idler_HeaterLabelRight_ring_0_v_E30) U2.235(IBIAS_2__17) U4.R1(AnalogLinks_Rx_8_N)
sig_B7: J1.B7 U1.N3(idler_PD_anode_3_v_E30) U2.254(H_2__18) U4.R2(AnalogLinks_TxIn_8_N)
sig_B8: J1.B8 U1.J1(Signal_HeaterLabelLeft_ring_1_2_fil_test) U2.250(IBIAS_1__18) U4.Q2(AnalogLinks_TxIn_8_P)
sig_B9: J1.B9 U1.J2(Signal_PD_anode_1_2_sig_fil_test) U2.253(H_1__18) U4.N2(AnalogLinks_TxIn_10_N)
sig_B10: J1.B10 U1.I2(Signal_PD_anode_2_2_sig_fil_test) U2.263(IBIAS_1__19) U4.L1(AnalogLinks_Rx_11_N)
sig_B11: J1.B11 U1.I1(Signal_HeaterLabelLeft_ring_2_2_fil_test) U2.267(H_2__19) U4.K1(AnalogLinks_Rx_11_P)
sig_B12: J1.B12 U1.J5(signal_PD_anode_0_0_sig_fil_test) U2.280(IBIAS_2__20) U4.G2(AnalogLinks_TxIn_13_P)
sig_B13: J1.B13 U1.J4(ASE_HeaterLabelRight_ring_0_v_E26) U2.282(H_1__20) U4.H2(AnalogLinks_TxIn_13_N)
sig_B14: J1.B14 U1.H4(Signal_HeaterLabelRight_ring_0_v_E26) U2.296(H_2__21) U4.I1(AnalogLinks_Rx_12_P)
sig_B15: J1.B15 U1.E3(Source_PD_Anode_2_comb_test) U2.293(IBIAS_2__21)
sig_B16: J1.B16 U1.E2(Signal_HeaterLabelLeft_ring_1_0_fil_test) U2.309(IBIAS_2__22) U4.I2(AnalogLinks_TxIn_12_P)
sig_B17: J1.B17 U1.E1(SPS_heater_VDD_0_2_fil_test) U2.312(H_2__22) U4.G1(AnalogLinks_Rx_13_P)
sig_B18: J1.B18 U1.F4(Signal_HeaterLabelRight_ring_2_v_E26) U2.325(H_2__23) U4.F1(AnalogLinks_Rx_14_N)
sig_B19: J1.B19 U1.B1(SPS_heater_VDD_0_1_src_test_v1) U2.322(IBIAS_2__23) U4.E1(AnalogLinks_Rx_14_P)
sig_C1: J1.C1 U1.O3(idler_PD_anode_2_v_E30) U2.192(IBIAS_1__14) U4.U9(AnalogLinks_s_out_bottom)
sig_C2: J1.C2 U1.O2(debug_PD_anode_v_E30) U2.210(H_3__15) U4.U8(S_OUT_2) U5.C5(s_in_1)
sig_C3: J1.C3 U1.O1(Signal_HeaterLabelRight_ring_3_v_E30) U2.221(IBIAS_1__16)
sig_C4: J1.C4 U1.P4(Signal_HeaterLabelRight_ring_1_v_E20) U2.222(IBIAS_2__16)
sig_C5: J1.C5 U1.P3(idler_PD_anode_1_v_E30) U2.237(H_1__17)
sig_C6: J1.C6 U1.P2(ASE_anode_1_v_E30) U2.233(IBIAS_0__17)
sig_C7: J1.C7 U1.N4(Signal_HeaterLabelRight_ring_3_v_E20) U2.249(IBIAS_0__18)
sig_C8: J1.C8 U1.K5(signal_PD_anode_1_0_sig_fil_test) U2.265(IBIAS_3__19)
sig_C9: J1.C9 U1.K4(PulseCurver_heater_GND_v_E26) U2.268(H_3__19)
sig_C10: J1.C10 U1.K3(Signal_PD_anode_3_1_sig_fil_test) U2.264(IBIAS_2__19) U4.B2(TX_CATHODE_BIAS) U4.B10(TX_CATHODE_BIAS) U4.U2(TX_CATHODE_BIAS) U4.U10(TX_CATHODE_BIAS)
sig_C11: J1.C11 U1.K2(Signal_PD_anode_0_2_sig_fil_test) U2.284(H_3__20) U4.A2(TX_ANODE_BIAS) U4.A10(TX_ANODE_BIAS) U4.T2(TX_ANODE_BIAS) U4.T10(TX_ANODE_BIAS)
sig_C12: J1.C12 U1.K1(Signal_HeaterLabelLeft_ring_0_2_fil_test) U2.281(IBIAS_3__20) U4.B11(VCM_AL)
sig_C13: J1.C13 U1.J3(Signal_PD_anode_2_0_sig_fil_test) U2.278(IBIAS_0__20) U4.A11(VCM_AL_OUT)
sig_C14: J1.C14 U1.H3(Signal_PD_anode_0_1_sig_fil_test) U2.294(IBIAS_3__21)
sig_C15: J1.C15 U1.H2(Signal_PD_anode_3_2_sig_fil_test) U2.297(H_3__21)
sig_C16: J1.C16 U1.H1(Signal_HeaterLabelLeft_ring_3_2_fil_test) U2.313(H_3__22)
sig_C17: J1.C17 U1.I5(Idler_HeaterLabelRight_ring_1_v_E26) U2.310(IBIAS_3__22)
sig_C18: J1.C18 U1.F3(Signal_PD_anode_2_1_sig_fil_test) U2.321(IBIAS_1__23) U4.C2(AnalogLinks_TxIn_15_P)
sig_C19: J1.C19 U1.B2(Signal_HeaterLabelLeft_ring_2_1_fil_test) U2.326(H_3__23) U4.D2(AnalogLinks_TxIn_15_N)
sig_D1: J1.D1 U1.Q4(Signal_HeaterLabelRight_ring_0_v_E20) U2.196(H_2__14) U4.S10(AnalogLinks_s_in_bottom) U5.U2(s_enable_2)
sig_D2: J1.D2 U1.Q5(Idler_HeaterLabelRight_ring_1_v_E20) U2.209(H_2__15) U4.S11(AnalogLinks_s_enable_bottom) U5.U1(s_in_2)
sig_D3: J1.D3 U1.P1(Signal_HeaterLabelRight_ring_2_v_E30) U2.224(H_1__16)
sig_D17: J1.D17 U1.G3(Signal_PD_anode_1_1_sig_fil_test) U2.320(IBIAS_0__23) U3.U8(s_clk_p)
sig_D18: J1.D18 U1.F2(Signal_HeaterLabelLeft_ring_2_0_fil_test) U2.324(H_1__23) U3.U11(s_enable) U4.C1(AnalogLinks_Rx_15_P)
sig_D19: J1.D19 U1.B3(Source_PD_Anode_1_src_test) U2.323(IBIAS_3__23) U4.D1(AnalogLinks_Rx_15_N)
sig_E1: J1.E1 U1.Q1(Signal_HeaterLabelRight_ring_1_v_E30) U2.193(IBIAS_2__14)
sig_E2: J1.E2 U1.Q2(ASE_anode_0_v_E30) U2.225(H_2__16)
sig_E3: J1.E3 U1.Q3(idler_PD_anode_0_v_E30) U2.220(IBIAS_0__16)
sig_E17: J1.E17 U1.D2(Signal_HeaterLabelLeft_ring_0_0_fil_test) U2.338(IBIAS_2__24) U3.U2(s_out)
sig_E18: J1.E18 U1.D3(ASE_anode_0_6_comb_test) U2.336(IBIAS_0__24) U3.U4(s_reset)
sig_E19: J1.E19 U1.B4(sig_idler__PD_cathods__combtest__cathodesrctest) U2.340(H_1__24)
sig_F1: J1.F1 U1.R2(Pulse_curver_PD_anode_v_E30) U2.197(H_3__14)
sig_F2: J1.F2 U1.R3(signal_PD_anode_0_v_E30) U2.195(H_1__14)
sig_F3: J1.F3 U1.R4(ASE_HeaterLabelRight_ring_1_v_E20) U2.191(IBIAS_0__14) U6.E11(pad_equip_reset)
sig_F17: J1.F17 U1.D1(ASE_HeaterLabelLeft_ring_0_comb_6_fil_test) U2.339(IBIAS_3__24) U3.A3(TIE_HI)
sig_F18: J1.F18 U1.D4(SPS_heater_GND_0_v_E26) U2.337(IBIAS_1__24) U3.U3(s_in)
sig_F19: J1.F19 U1.B5(ASE_cathode_0_4__7__E44__4_wires) U2.341(H_2__24) U3.U10(s_update)
sig_G1: J1.G1 U1.R1(Signal_HeaterLabelRight_ring_0_v_E30) U2.176(IBIAS_1__13) U6.D11(pad_rx_reset)
sig_G2: J1.G2 U1.S3(signal_PD_anode_1_v_E30) U2.175(IBIAS_0__13) U6.G10(pad_s_clk_n)
sig_G3: J1.G3 U1.S1(ASE_HeaterLabelRight_ring_1_v_E30) U2.194(IBIAS_3__14) U6.G9(TESTVD)
sig_G17: J1.G17 U1.D5(Idler_HeaterLabelRight_ring_3_v_E26) U2.342(H_3__24) U3.A5(TIE_LO)
sig_G18: J1.G18 U1.A3(Source_PD_Anode_5_src_test) U2.304(BIAS_1__21_22) U2.333(BIAS_1__23_24) U3.U1(reset)
sig_G19: J1.G19 U1.A4(ASE_anode_0_7) U2.305(BIAS_2__21_22) U2.334(BIAS_2__23_24) U3.U9(s_clk_n)
sig_H1: J1.H1 U1.S4(ASE_HeaterLabelRight_ring_0_v_E20) U2.179(H_1__13) U6.E10(pad_TIE_LO)
sig_H2: J1.H2 U1.T3(signal_PD_anode_2_v_E30) U2.178(IBIAS_3__13) U6.G8(TESTVG)
sig_H3: J1.H3 U1.T1(ASE_HeaterLabelRight_ring_0_v_E30) U2.177(IBIAS_2__13) U6.G11(pad_s_clk_p)
sig_H17: J1.H17 U1.A1(SPS_heater_VDD_0_5_src_test_v1) U2.306(BIAS_3__21_22) U2.335(BIAS_3__23_24)
sig_J1: J1.J1 U1.U4(all_cathods_v_E30__shared_ground) U2.246(BIAS_1__17_18) U2.275(BIAS_1__19_20) U6.D10(pad_TIE_HI)
sig_J2: J1.J2 U1.U1(PulseCurver_heater_VDD_v_E30) U2.181(H_3__13) U6.A11(pad_s_in)
sig_J3: J1.J3 U1.U3(signal_PD_anode_3_v_E30) U2.180(H_2__13) U6.B11(pad_s_enable_rx)
sig_J17: J1.J17 U1.A5(ASE_anode_0_6_E44) U2.53(BIAS_4__4) U2.298(BIAS_4__21) U2.314(BIAS_4__22) U2.327(BIAS_4__23) U2.343(BIAS_4__24) U2.365(NC__C_16) U4.H11(AnalogLinks_Rx_5_N)
sig_K1: J1.K1 U1.T4(PulseCurver_heater_VDD_v_E20) U2.248(BIAS_3__17_18) U2.277(BIAS_3__19_20) U6.F9(VPD)
sig_K2: J1.K2 U2.247(BIAS_2__17_18) U2.276(BIAS_2__19_20) U6.A10(pad_s_reset)
sig_K3: J1.K3 U1.M6(signal_PD_anode_0_v_E20) U2.24(BIAS_4__2) U2.198(BIAS_4__14) U2.227(BIAS_4__16) U2.240(BIAS_4__17) U2.256(BIAS_4__18) U2.269(BIAS_4__19) U2.285(BIAS_4__20) U2.352(NC__C_3) U2.353(NC__C_4) U2.356(NC__C_7) U2.359(NC__C_10) U6.C11(pad_rx_reset_async)
sig_K17: J1.K17 U1.A6(ASE_anode_0_5_E44) U2.37(BIAS_4__3) U2.124(BIAS_4__9) U2.140(BIAS_4__10) U2.153(BIAS_4__11) U2.169(BIAS_4__12) U4.G11(AnalogLinks_Rx_5_P)
sig_L1: J1.L1 U1.O6(idler_PD_anode_1_v_E20) U2.14(BIAS_1__1_2) U2.72(BIAS_1__5_6) U2.101(BIAS_1__7_8) U2.188(BIAS_1__13_14) U2.217(BIAS_1__15_16) U6.A9(pad_s_update)
sig_L2: J1.L2 U1.Q6(idler_PD_anode_3_v_E20) U2.15(BIAS_2__1_2) U2.73(BIAS_2__5_6) U2.102(BIAS_2__7_8) U2.189(BIAS_2__13_14) U2.218(BIAS_2__15_16) U6.C8(VREF0)
sig_L3: J1.L3 U1.P6(idler_PD_anode_2_v_E20) U2.16(BIAS_3__1_2) U2.74(BIAS_3__5_6) U2.103(BIAS_3__7_8) U2.190(BIAS_3__13_14) U2.219(BIAS_3__15_16) U2.357(NC__C_8) U2.358(NC__C_9) U6.B10(pad_s_enable_tx)
sig_L16: J1.L16 U2.44(BIAS_2__3_4) U2.131(BIAS_2__9_10) U2.160(BIAS_2__11_12)
sig_L17: J1.L17 U1.B6(ASE_anode_0_4_E44) U2.45(BIAS_3__3_4) U2.132(BIAS_3__9_10) U2.161(BIAS_3__11_12) U4.F10(AnalogLinks_TxIn_6_N)
sig_M1: J1.M1 U1.T7(debug_PD_anode_v_E20) U2.8(BIAS_4__1) U2.66(BIAS_4__5) U2.82(BIAS_4__6) U2.95(BIAS_4__7) U2.111(BIAS_4__8) U2.182(BIAS_4__13) U2.211(BIAS_4__15) U6.A8(IREF)
sig_M2: J1.M2 U1.U7(through_PD_anode_v_E20) U2.7(H_3__1) U6.B7(VTERM)
sig_M3: J1.M3 U1.N6(idler_PD_anode_0_v_E20) U2.6(H_2__1) U6.B9(pad_s_enable_equip)
sig_M16: J1.M16 U2.43(BIAS_1__3_4) U2.130(BIAS_1__9_10) U2.159(BIAS_1__11_12)
sig_M17: J1.M17 U2.168(H_3__12) U4.E10(AnalogLinks_TxIn_6_P)
sig_N1: J1.N1 U1.S8(ASE_HeaterLabelRight_ring_0_v_E5) U2.5(H_1__1)
sig_N2: J1.N2 U1.T8(PulseCurver_heater_GND_v_E5) U2.4(IBIAS_3__1) U5.A1(TIE_HI)
sig_N3: J1.N3 U1.S7(ASE_anode_1_v_E20) U2.3(IBIAS_2__1)
sig_N16: J1.N16 U2.403(IBIAS_3__DEEMB)
sig_N17: J1.N17 U1.F7(all_cathods_v_E26) U2.166(H_1__12)
sig_N18: J1.N18 U1.D7(Source_PD_Anode_v_E26) U2.167(H_2__12) U4.B9(S_OUT_1)
sig_N19: J1.N19 U1.G6(idler_PD_anode_1_v_E26) U2.162(IBIAS_0__12) U4.A3(TIE_HI)
sig_P1: J1.P1 U1.Q7(Pulse_curver_PD_anode_v_E20) U2.2(IBIAS_1__1)
sig_P2: J1.P2 U1.R8(ASE_HeaterLabelRight_ring_1_v_E5) U2.1(IBIAS_0__1) U5.A2(TIE_LO)
sig_P3: J1.P3 U1.R7(ASE_anode_0_v_E20) U2.23(H_3__2)
sig_P16: J1.P16 U2.402(IBIAS_2__DEEMB)
sig_P17: J1.P17 U1.G8(Signal_HeaterLabelRight_ring_0_v_E12) U2.165(IBIAS_3__12)
sig_P18: J1.P18 U1.C8(Idler_HeaterLabelRight_ring_0_v_E12) U2.164(IBIAS_2__12) U4.B8(s_clk_n)
sig_P19: J1.P19 U1.D6(signal_PD_anode_1_v_E26) U2.163(IBIAS_1__12) U4.B4(s_in_1)
sig_R1: J1.R1 U1.Q9(Idler_HeaterLabelRight_ring_1_v_E5) U2.22(H_2__2) U5.U4(s_clk_p)
sig_R2: J1.R2 U1.P7(input_PD_anode_v_E20) U2.21(H_1__2) U5.A3(Reset)
sig_R3: J1.R3 U1.Q8(Signal_HeaterLabelRight_ring_0_v_E5) U2.20(IBIAS_3__2)
sig_R15: J1.R15 U2.400(IBIAS_0__DEEMB)
sig_R16: J1.R16 U2.401(IBIAS_1__DEEMB)
sig_R17: J1.R17 U1.G7(Pulse_curver_PD_anode_v_E26) U2.148(IBIAS_2__11)
sig_R18: J1.R18 U1.D8(Signal_HeaterLabelLeft_ring_3_v_E12) U2.152(H_3__11) U4.A8(s_clk_p)
sig_R19: J1.R19 U1.E6(signal_PD_anode_0_v_E26) U2.149(IBIAS_3__11) U4.A4(TIE_LO)
sig_T1: J1.T1 U1.P8(Signal_HeaterLabelRight_ring_1_v_E5) U2.19(IBIAS_2__2) U5.T9(s_enable_3) U6.D2(ibias_rx_2)
sig_T2: J1.T2 U1.Q10(idler_PD_anode_3_v_E5) U2.18(IBIAS_1__2) U5.U10(s_in_4) U6.C4(PD_BIAS_N)
sig_T3: J1.T3 U1.U11(through_PD_anode_v_E5) U2.17(IBIAS_0__2)
sig_T17: J1.T17 U1.H8(SPS_heater_VDD_0_v_E12) U2.150(H_1__11)
sig_T18: J1.T18 U1.E7(input_PD_anode_v_E26) U2.147(IBIAS_1__11) U4.B7(S_ENABLE_1)
sig_T19: J1.T19 U1.B7(signal_PD_anode_3_v_E26) U2.151(H_2__11) U4.B5(s_update)
sig_U1: J1.U1 U1.I6(idler_PD_anode_3_v_E26) U2.36(H_3__3) U5.U9(s_enable_4) U6.D5(PD_BIAS_P)
sig_U2: J1.U2 U1.L6(signal_PD_anode_1_v_E20) U2.30(IBIAS_0__3) U5.U11(s_out_4) U6.B1(hs_clk_ibias)
sig_U3: J1.U3 U1.H6(idler_PD_anode_2_v_E26) U2.33(IBIAS_3__3)
sig_U4: J1.U4 U1.O7(Source_PD_Anode_v_E20) U2.48(IBIAS_2__4)
sig_U5: J1.U5 U1.N7(all_cathods_v_E20__shared_ground) U2.50(H_1__4)
sig_U6: J1.U6 U1.M7(signal_PD_anode_2_v_E20) U2.63(H_1__5)
sig_U7: J1.U7 U1.M8(SPS_heater_GND_0_v_E5) U2.62(IBIAS_3__5)
sig_U8: J1.U8 U1.L7(signal_PD_anode_3_v_E20) U2.77(IBIAS_2__6)
sig_U9: J1.U9 U1.L8(Idler_HeaterLabelRight_ring_0_v_E5) U2.79(H_1__6)
sig_U10: J1.U10 U1.K7(through_PD_anode_v_E26) U2.92(H_1__7)
sig_U11: J1.U11 U1.P11(input_PD_anode_v_E5) U2.90(IBIAS_2__7)
sig_U12: J1.U12 U1.O8(Signal_HeaterLabelRight_ring_2_v_E5) U2.107(IBIAS_3__8)
sig_U13: J1.U13 U1.M10(signal_PD_anode_0_v_E5) U2.109(H_2__8)
sig_U14: J1.U14 U1.J11(Source_PD_Anode_v_E12) U2.104(IBIAS_0__8)
sig_U15: J1.U15 U1.G10(idler_PD_anode_3_v_E12) U2.118(IBIAS_1__9)
sig_U16: J1.U16 U1.C10(signal_PD_anode_0_v_E12) U2.123(H_3__9)
sig_U17: J1.U17 U1.H7(ASE_anode_0_v_E26) U2.137(H_1__10)
sig_U18: J1.U18 U1.F6(idler_PD_anode_0_v_E26) U2.133(IBIAS_0__10) U4.A7(s_reset)
sig_U19: J1.U19 U1.C7(signal_PD_anode_2_v_E26) U2.146(IBIAS_0__11) U4.B6(reset)
sig_V1: J1.V1 U1.K8(PulseCurver_heater_VDD_v_E12) U2.35(H_2__3) U5.T8(s_out_0) U6.F5(VREF2)
sig_V2: J1.V2 U1.J7(debug_PD_anode_v_E26) U2.31(IBIAS_1__3) U5.S9(s_in_3) U6.B2(MOD_HV)
sig_V3: J1.V3 U1.J8(ASE_HeaterLabelRight_ring_0_v_E12) U2.49(IBIAS_3__4) U5.I9(s_out_3) U6.C2(ibias_rx_1)
sig_V4: J1.V4 U1.I7(ASE_anode_1_v_E26) U2.51(H_2__4) U5.A5(s_enable_1) U6.D3(VREF1)
sig_V5: J1.V5 U1.I8(ASE_HeaterLabelRight_ring_1_v_E12) U2.46(IBIAS_0__4) U5.B4(s_reset) U6.B3(PS_HEAT)
sig_V6: J1.V6 U1.T11(debug_PD_anode_v_E5) U2.60(IBIAS_1__5) U4.R10(AnalogLinks_TxIn_0_N)
sig_V7: J1.V7 U1.S11(ASE_anode_1_v_E5) U2.65(H_3__5) U4.Q10(AnalogLinks_TxIn_0_P)
sig_V8: J1.V8 U1.R11(ASE_anode_0_v_E5) U2.81(H_3__6) U4.R11(AnalogLinks_Rx_0_N)
sig_V9: J1.V9 U1.Q11(ASE_anode_0_v_E5) U2.76(IBIAS_1__6) U4.Q11(AnalogLinks_Rx_0_P)
sig_V10: J1.V10 U1.P10(idler_PD_anode_2_v_E5) U2.88(IBIAS_0__7) U4.P10(AnalogLinks_TxIn_1_N)
sig_V11: J1.V11 U1.O11(Source_PD_Anode_v_E5) U2.93(H_2__7) U4.O10(AnalogLinks_TxIn_1_P)
sig_V12: J1.V12 U1.M11(signal_PD_anode_2_v_E5) U2.91(IBIAS_3__7) U4.P11(AnalogLinks_Rx_1_N)
sig_V13: J1.V13 U1.L9(Idler_HeaterLabelRight_ring_3_v_E5) U2.106(IBIAS_2__8) U4.O11(AnalogLinks_Rx_1_P)
sig_V14: J1.V14 U1.F11(Pulse_curver_PD_anode_v_E12) U2.108(H_1__8) U4.L11(AnalogLinks_Rx_3_N)
sig_V15: J1.V15 U1.F10(idler_PD_anode_2_v_E12) U2.121(H_1__9) U4.K11(AnalogLinks_Rx_3_P)
sig_V16: J1.V16 U1.C11(signal_PD_anode_2_v_E12) U2.119(IBIAS_2__9) U4.G10(AnalogLinks_TxIn_5_P)
sig_V17: J1.V17 U1.C9(Idler_HeaterLabelRight_ring_3_v_E12) U2.135(IBIAS_2__10) U4.F11(AnalogLinks_Rx_6_N)
sig_V18: J1.V18 U1.F8(Signal_HeaterLabelRight_ring_1_v_E12) U2.138(H_2__10) U4.C10(AnalogLinks_TxIn_7_P)
sig_V19: J1.V19 U1.E8(Signal_HeaterLabelRight_ring_2_v_E12) U2.134(IBIAS_1__10) U4.C11(AnalogLinks_Rx_7_P)
sig_W1: J1.W1 U1.O10(idler_PD_anode_1_v_E5) U2.34(H_1__3) U5.T6(s_in_0) U6.E2(MOD_HEAT)
sig_W2: J1.W2 U1.N11(all_cathods_v_E5__shared_ground) U2.32(IBIAS_2__3) U5.U6(s_enable_0) U6.E1(pad_s_out_tx)
sig_W3: J1.W3 U1.N10(idler_PD_anode_0_v_E5) U2.52(H_3__4) U5.T5(s_update) U6.F2(pad_s_out_equip)
sig_W4: J1.W4 U1.L11(signal_PD_anode_3_v_E5) U2.47(IBIAS_1__4) U5.U5(s_clk_n) U6.F1(pad_s_out_rx)
sig_W5: J1.W5 U1.L10(signal_PD_anode_1_v_E5) U2.59(IBIAS_0__5) U5.T4(s_out_2) U6.F7(VB_RING)
sig_W6: J1.W6 U1.K11(through_PD_anode_v_E12) U2.64(H_2__5) U4.N10(AnalogLinks_TxIn_2_N)
sig_W7: J1.W7 U1.M9(Idler_HeaterLabelRight_ring_2_v_E5) U2.61(IBIAS_2__5) U4.M10(AnalogLinks_TxIn_2_P)
sig_W8: J1.W8 U1.I11(debug_PD_anode_v_E12) U2.78(IBIAS_3__6) U4.N11(AnalogLinks_Rx_2_N)
sig_W9: J1.W9 U1.N8(Signal_HeaterLabelRight_ring_3_v_E5) U2.80(H_2__6) U4.M11(AnalogLinks_Rx_2_P)
sig_W10: J1.W10 U1.H11(ASE_anode_1_v_E12) U2.75(IBIAS_0__6) U4.L10(AnalogLinks_TxIn_3_N)
sig_W11: J1.W11 U1.H9(Idler_HeaterLabelRight_ring_1_v_E12) U2.89(IBIAS_1__7) U4.K10(AnalogLinks_TxIn_3_P)
sig_W12: J1.W12 U1.G11(ASE_anode_0_v_E12) U2.94(H_3__7) U4.J10(AnalogLinks_TxIn_4_N)
sig_W13: J1.W13 U1.E11(input_PD_anode_v_E12) U2.110(H_3__8) U4.I10(AnalogLinks_TxIn_4_P)
sig_W14: J1.W14 U1.E10(idler_PD_anode_1_v_E12) U2.105(IBIAS_1__8) U4.J11(AnalogLinks_Rx_4_N)
sig_W15: J1.W15 U1.D11(Pulse_curverAndPD_cathode_v_E12__all_cathodes) U2.117(IBIAS_0__9) U4.I11(AnalogLinks_Rx_4_P)
sig_W16: J1.W16 U1.D10(idler_PD_anode_0_v_E12) U2.122(H_2__9) U4.H10(AnalogLinks_TxIn_5_N)
sig_W17: J1.W17 U1.B11(signal_PD_anode_3_v_E12) U2.120(IBIAS_3__9) U4.E11(AnalogLinks_Rx_6_P)
sig_W18: J1.W18 U1.B10(signal_PD_anode_1_v_E12) U2.136(IBIAS_3__10) U4.D10(AnalogLinks_TxIn_7_N)
sig_W19: J1.W19 U1.D9(Idler_HeaterLabelRight_ring_2_v_E12) U2.139(H_3__10) U4.D11(AnalogLinks_Rx_7_N)
TXVDD: J1.F12 J1.F13 U4.E3(TXVDD) U4.E4(TXVDD) U4.E9(TXVDD) U4.F9(TXVDD) U4.P9(TXVDD) U4.Q3(TXVDD) U4.Q4(TXVDD) U4.Q9(TXVDD)
us__CML_clk_n: J1.D6 U5.K1(CML_clkn)
us__CML_clk_p: J1.D5 U5.K2(CML_clkp)
us__rx_out_0_n: J1.D4 U5.O2(rx_out_n_0)
us__rx_out_0_p: J1.E4 U5.O1(rx_out_p_0)
us__rx_out_1_n: J1.E12 U5.G1(rx_out_n_1)
us__rx_out_1_p: J1.E11 U5.G2(rx_out_p_1)
us__rx_out_2_n: J1.D12 U5.F1(rx_out_n_2)
us__rx_out_2_p: J1.D11 U5.F2(rx_out_p_2)
us__rx_out_3_n: J1.M5 U5.P2(rx_out_n_3)
us__rx_out_3_p: J1.M4 U5.P1(rx_out_p_3)
us__rx_out_4_n: J1.K4 U5.Q2(rx_out_n_4)
us__rx_out_4_p: J1.L4 U5.Q1(rx_out_p_4)
us__rx_out_5_n: J1.D10 U5.E1(rx_out_n_5)
us__rx_out_5_p: J1.D9 U5.E2(rx_out_p_5)
us__rx_out_6_n: J1.D8 U5.D1(rx_out_n_6)
us__rx_out_6_p: J1.D7 U5.D2(rx_out_p_6)
us__rx_out_7_n: J1.K5 U5.R2(rx_out_n_7)
us__rx_out_7_p: J1.L5 U5.R1(rx_out_p_7)
us__rx_out_8_n: J1.J5 U5.L11(rx_out_n_8)
us__rx_out_8_p: J1.H5 U5.K11(rx_out_p_8)
us__rx_out_9_n: J1.E8 U5.A9(rx_out_n_9)
us__rx_out_9_p: J1.E7 U5.A8(rx_out_p_9)
us__rx_out_10_n: J1.E9 U5.A11(rx_out_n_10)
us__rx_out_10_p: J1.E10 U5.A10(rx_out_p_10)
us__rx_out_11_n: J1.G5 U5.J11(rx_out_n_11)
us__rx_out_11_p: J1.F5 U5.I11(rx_out_p_11)
us__rx_out_12_n: J1.G4 U5.P11(rx_out_n_12)
us__rx_out_12_p: J1.F4 U5.O11(rx_out_p_12)
us__rx_out_13_n: J1.E5 U5.E11(rx_out_n_13)
us__rx_out_13_p: J1.E6 U5.D11(rx_out_p_13)
us__rx_out_14_n: J1.J4 U5.R11(rx_out_n_14)
us__rx_out_14_p: J1.H4 U5.Q11(rx_out_p_14)
VDD: J1.H7 J1.J6 J1.K7 J1.K8 J1.L6 J1.L8 J1.M7 J1.N6 J1.N8 J1.P7 U2.10(VDD_0__1_2) U2.12(VDD_1__1_2) U2.39(VDD_0__3_4) U2.41(VDD_1__3_4) U2.68(VDD_0__5_6) U2.70(VDD_1__5_6) U2.97(VDD_0__7_8) U2.99(VDD_1__7_8) U2.126(VDD_0__9_10) U2.128(VDD_1__9_10) U2.155(VDD_0__11_12) U2.157(VDD_1__11_12) U2.184(VDD_0__13_14) U2.186(VDD_1__13_14) U2.213(VDD_0__15_16) U2.215(VDD_1__15_16) U2.242(VDD_0__17_18) U2.244(VDD_1__17_18) U2.271(VDD_0__19_20) U2.273(VDD_1__19_20) U2.300(VDD_0__21_22) U2.302(VDD_1__21_22) U2.329(VDD_0__23_24) U2.331(VDD_1__23_24) U2.406(VDD_0__DEEMB) U2.408(VDD_1__DEEMB) U3.A11(VDD) U3.B3(VDD) U3.B5(VDD) U3.B8(VDD) U3.B11(VDD) U3.C3(VDD) U3.C5(VDD) U3.C8(VDD) U3.C11(VDD) U3.D1(VDD) U3.D6(VDD) U3.D9(VDD) U3.E1(VDD) U3.E6(VDD) U3.E9(VDD) U3.F3(VDD) U3.F5(VDD) U3.F8(VDD) U3.F11(VDD) U3.G3(VDD) U3.G5(VDD) U3.G8(VDD) U3.G11(VDD) U3.H1(VDD) U3.H6(VDD) U3.H9(VDD) U3.I1(VDD) U3.I6(VDD) U3.I9(VDD) U3.J3(VDD) U3.J5(VDD) U3.J8(VDD) U3.J11(VDD) U3.K3(VDD) U3.K5(VDD) U3.K8(VDD) U3.K11(VDD) U3.L1(VDD) U3.L6(VDD) U3.L9(VDD) U3.M1(VDD) U3.M6(VDD) U3.M9(VDD) U3.N3(VDD) U3.N5(VDD) U3.N8(VDD) U3.N11(VDD) U3.O3(VDD) U3.O5(VDD) U3.O8(VDD) U3.O11(VDD) U3.P1(VDD) U3.P6(VDD) U3.P9(VDD) U3.Q1(VDD) U3.Q6(VDD) U3.Q9(VDD) U3.R3(VDD) U3.R5(VDD) U3.R8(VDD) U3.R11(VDD) U3.S3(VDD) U3.S5(VDD) U3.S8(VDD) U3.S11(VDD) U4.C7(VDD) U4.C8(VDD) U4.H3(VDD) U4.I3(VDD) U4.I7(VDD) U4.M6(VDD) U4.N6(VDD) U4.R5(VDD) U4.S5(VDD) U5.C7(VDD) U5.D7(VDD) U5.I5(VDD) U5.I6(VDD) U5.K8(VDD) U5.L8(VDD) U5.M4(VDD) U5.M5(VDD) U5.N5(VDD) U5.Q7(VDD) U5.Q8(VDD) U5.S4(VDD) U5.S5(VDD) U5.S6(VDD) U5.T10(VDD) U6.D7(VDD) U6.D8(VDD) U6.E7(VDD) U6.F6(VDD)
VPD: J1.F10 U4.C3(VPD) U4.C4(VPD) U4.D7(VPD) U4.D8(VPD) U4.H4(VPD) U4.I4(VPD) U4.K5(VPD) U4.K6(VPD) U4.O8(VPD) U4.O9(VPD) U4.T3(VPD) U4.T9(VPD) U5.E8(VPD) U5.L5(VPD) U5.L6(VPD)
VREF0: J1.F9 U4.A1(VREF0) U4.F5(VREF0) U4.G5(VREF0) U4.N5(VREF0) U4.O5(VREF0) U4.T5(VREF0) U5.G6(VREF0) U5.H6(VREF0) U5.N6(VREF0) U5.O6(VREF0) U5.T11(VREF0)
VREF1: J1.F8 U4.F6(VREF1) U4.G6(VREF1) U4.O6(VREF1) U4.P6(VREF1) U4.S1(VREF1) U4.T6(VREF1) U5.E6(VREF1) U5.E7(VREF1) U5.N7(VREF1) U5.O7(VREF1)
VREF2: J1.F7 U4.B1(VREF2) U4.F7(VREF2) U4.G7(VREF2) U4.N7(VREF2) U4.O7(VREF2) U4.T7(VREF2) U5.E5(VREF2) U5.F5(VREF2) U5.M6(VREF2) U5.M7(VREF2)
VSS: J1.D13 J1.D16 J1.E13 J1.F6 J1.F14 J1.F15 J1.G7 J1.G9 J1.G14 J1.G15 J1.G16 J1.H6 J1.H8 J1.H10 J1.H12 J1.H15 J1.J7 J1.J9 J1.J11 J1.J14 J1.K6 J1.K9 J1.K11 J1.K13 J1.K15 J1.K16 J1.L7 J1.L9 J1.L10 J1.L12 J1.L14 J1.M6 J1.M8 J1.M9 J1.M11 J1.M13 J1.M15 J1.N5 J1.N7 J1.N9 J1.N10 J1.N12 J1.N14 J1.P5 J1.P6 J1.P8 J1.P9 J1.P10 J1.P11 J1.P12 J1.P13 J1.P14 J1.P15 J1.R5 J1.R6 J1.R7 J1.R8 J1.R9 J1.R10 J1.R11 J1.R12 J1.R13 J1.R14 PB6.1(G) PB6.3(G) PB9.1(G) PB9.3(G) PB10.1(G) PB10.3(G) PB11.1(G) PB11.3(G) PB13.1(G) PB13.2(S) PB13.3(G) PB14.1(G) PB14.2(S) PB14.3(G) PB31.1(G) PB31.3(G) PB32.1(G) PB32.3(G) PB33.1(G) PB33.3(G) PB34.1(G) PB34.3(G) R1.1 R2.1 U1.A2(Signal_HeaterLabelRight_GND__all_heaters) U1.A7(NC28) U1.A8(NC30) U1.A9(NC32) U1.A10(NC33) U1.A11(NC34) U1.B8(NC29) U1.B9(NC31) U1.C5(NC26) U1.C6(NC27) U1.G9(Signal/Idler_HeaterLabelLeft_ring_v_E12__shared_ground) U1.H5(all_heaters_GND_v_E26) U1.H10(NC25) U1.I9(NC21) U1.I10(NC24) U1.J6(NC18) U1.J9(NC20) U1.J10(NC23) U1.K6(NC17) U1.K9(NC19) U1.K10(NC22) U1.P5(all_heaters_GND_v_E20) U1.P9(Signal/Idler_HeaterLabelLeft_rings_v_E5__shared_ground) U1.R5(NC3) U1.R6(NC7) U1.R9(NC12) U1.R10(NC16) U1.S2(all_heaters_GND_v_E30) U1.S5(NC2) U1.S6(NC6) U1.S9(NC11) U1.S10(NC15) U1.T5(NC1) U1.T6(NC5) U1.T9(NC10) U1.T10(NC14) U1.U5(NC0) U1.U6(NC4) U1.U8(NC8) U1.U9(NC9) U1.U10(NC13) U2.9(VSS_0__1_2) U2.11(VSS_1__1_2) U2.13(VSS_2__1_2) U2.38(VSS_0__3_4) U2.40(VSS_1__3_4) U2.42(VSS_2__3_4) U2.67(VSS_0__5_6) U2.69(VSS_1__5_6) U2.71(VSS_2__5_6) U2.96(VSS_0__7_8) U2.98(VSS_1__7_8) U2.100(VSS_2__7_8) U2.125(VSS_0__9_10) U2.127(VSS_1__9_10) U2.129(VSS_2__9_10) U2.154(VSS_0__11_12) U2.156(VSS_1__11_12) U2.158(VSS_2__11_12) U2.183(VSS_0__13_14) U2.185(VSS_1__13_14) U2.187(VSS_2__13_14) U2.212(VSS_0__15_16) U2.214(VSS_1__15_16) U2.216(VSS_2__15_16) U2.241(VSS_0__17_18) U2.243(VSS_1__17_18) U2.245(VSS_2__17_18) U2.270(VSS_0__19_20) U2.272(VSS_1__19_20) U2.274(VSS_2__19_20) U2.299(VSS_0__21_22) U2.301(VSS_1__21_22) U2.303(VSS_2__21_22) U2.328(VSS_0__23_24) U2.330(VSS_1__23_24) U2.332(VSS_2__23_24) U2.405(VSS_0__DEEMB) U2.407(VSS_1__DEEMB) U2.409(VSS_2__DEEMB) U3.A1(VSS) U3.A6(VSS) U3.B1(VSS) U3.B6(VSS) U3.B9(VSS) U3.C1(VSS) U3.C6(VSS) U3.C9(VSS) U3.D2(VSS) U3.D4(VSS) U3.D7(VSS) U3.D10(VSS) U3.E2(VSS) U3.E4(VSS) U3.E7(VSS) U3.E10(VSS) U3.F1(VSS) U3.F6(VSS) U3.F9(VSS) U3.G1(VSS) U3.G6(VSS) U3.G9(VSS) U3.H2(VSS) U3.H4(VSS) U3.H7(VSS) U3.H10(VSS) U3.I2(VSS) U3.I4(VSS) U3.I7(VSS) U3.I10(VSS) U3.J1(VSS) U3.J6(VSS) U3.J9(VSS) U3.K1(VSS) U3.K6(VSS) U3.K9(VSS) U3.L2(VSS) U3.L4(VSS) U3.L7(VSS) U3.L10(VSS) U3.M2(VSS) U3.M4(VSS) U3.M7(VSS) U3.M10(VSS) U3.N1(VSS) U3.N6(VSS) U3.N9(VSS) U3.O1(VSS) U3.O6(VSS) U3.O9(VSS) U3.P2(VSS) U3.P4(VSS) U3.P7(VSS) U3.P10(VSS) U3.Q2(VSS) U3.Q4(VSS) U3.Q7(VSS) U3.Q10(VSS) U3.R1(VSS) U3.R6(VSS) U3.R9(VSS) U3.S1(VSS) U3.S6(VSS) U3.S9(VSS) U3.T3(VSS) U3.T4(VSS) U3.T7(VSS) U3.T8(VSS) U3.U7(VSS) U4.C9(VSS) U4.D3(VSS) U4.D4(VSS) U4.D6(VSS) U4.D9(VSS) U4.E6(VSS) U4.E7(VSS) U4.G3(VSS) U4.G4(VSS) U4.H5(VSS) U4.H6(VSS) U4.I6(VSS) U4.I8(VSS) U4.I9(VSS) U4.J3(VSS) U4.J4(VSS) U4.J9(VSS) U4.L7(VSS) U4.L9(VSS) U4.M3(VSS) U4.M4(VSS) U4.M7(VSS) U4.M8(VSS) U4.M9(VSS) U4.O3(VSS) U4.O4(VSS) U4.P5(VSS) U4.Q5(VSS) U4.R7(VSS) U4.R8(VSS) U4.S3(VSS) U4.S4(VSS) U4.S8(VSS) U4.U6(VSS) U5.A4(VSS) U5.A6(VSS) U5.B1(VSS) U5.B2(VSS) U5.B3(VSS) U5.B5(VSS) U5.B7(VSS) U5.B11(VSS) U5.C4(VSS) U5.C9(VSS) U5.C10(VSS) U5.D4(VSS) U5.D8(VSS) U5.D9(VSS) U5.E4(VSS) U5.E9(VSS) U5.F4(VSS) U5.F9(VSS) U5.G4(VSS) U5.G9(VSS) U5.G10(VSS) U5.G11(VSS) U5.H4(VSS) U5.H8(VSS) U5.H9(VSS) U5.H11(VSS) U5.I1(VSS) U5.I2(VSS) U5.I3(VSS) U5.I4(VSS) U5.I8(VSS) U5.I10(VSS) U5.J4(VSS) U5.J5(VSS) U5.J6(VSS) U5.J9(VSS) U5.K9(VSS) U5.K10(VSS) U5.L2(VSS) U5.L9(VSS) U5.M1(VSS) U5.M2(VSS) U5.M8(VSS) U5.M9(VSS) U5.M10(VSS) U5.N3(VSS) U5.N9(VSS) U5.N11(VSS) U5.O4(VSS) U5.O9(VSS) U5.O10(VSS) U5.P4(VSS) U5.P9(VSS) U5.Q4(VSS) U5.Q5(VSS) U5.Q6(VSS) U5.Q9(VSS) U5.Q10(VSS) U5.R4(VSS) U5.R7(VSS) U5.R9(VSS) U5.S3(VSS) U5.S7(VSS) U5.S10(VSS) U5.T1(VSS) U5.T2(VSS) U5.T7(VSS) U5.U8(VSS) U6.B4(VSS) U6.B5(VSS) U6.B6(VSS) U6.B8(VSS) U6.C9(VSS) U6.C10(VSS) U6.D9(VSS) U6.E8(VSS) U6.E9(VSS) U6.F8(VSS) U6.F10(VSS) U6.F11(VSS) U6.X1 U6.X2 U6.X3 U6.X4 U6.X5 U6.X6 U6.X7 U6.X8 U6.X9 U6.X10 U6.Y1 U6.Y2 U6.Y3 U6.Y4 U6.Y5 U6.Y6 U6.Y7 U6.Y8 U6.Y9 U6.Y10 U6.Z1 U6.Z2 U6.Z3 U6.Z4 U6.Z5 U6.Z6 U6.Z7 U6.Z8 U6.Z9 U6.Z10

Not connected (* = marked no-connect by the designer): U2 349(NC__C_0)* 350(NC__C_1)* 351(NC__C_2)* 354(NC__C_5)* 355(NC__C_6)* 360(NC__C_11)* 361(NC__C_12)* 362(NC__C_13)* 363(NC__C_14)* 364(NC__C_15)* 366(NC__C_17)* 404(NC_0__DEEMB)*

### Notes on the sheet
- Probe Deembedding sites
- Don't forget to flip these two signals on the host board
- (near U6) Note: The bump order of footprint and layout are opposite.
- (due to flip-chip attach)
- (in symbol Biolinks) A1 is top left in footprint; U1 is top right; U11 is bottom right;; Flipped MY relative to chip bump map;
- (in symbol Equip) A1 is top left in footprint; U1 is top right; U11 is bottom right;; Flipped MY relative to chip bump map;
- (in symbol FPA) A1 is top left in footprint; U1 is top right; U11 is bottom right;; Flipped MY relative to chip bump map;
- (in symbol Ultrasound) A1 is top left in footprint; U1 is top right; U11 is bottom right;; Flipped MY relative to chip bump map;